# EAGLE design BlueBoltzESC (EAGLE 8.7.1)

## Sheet 1 of 6
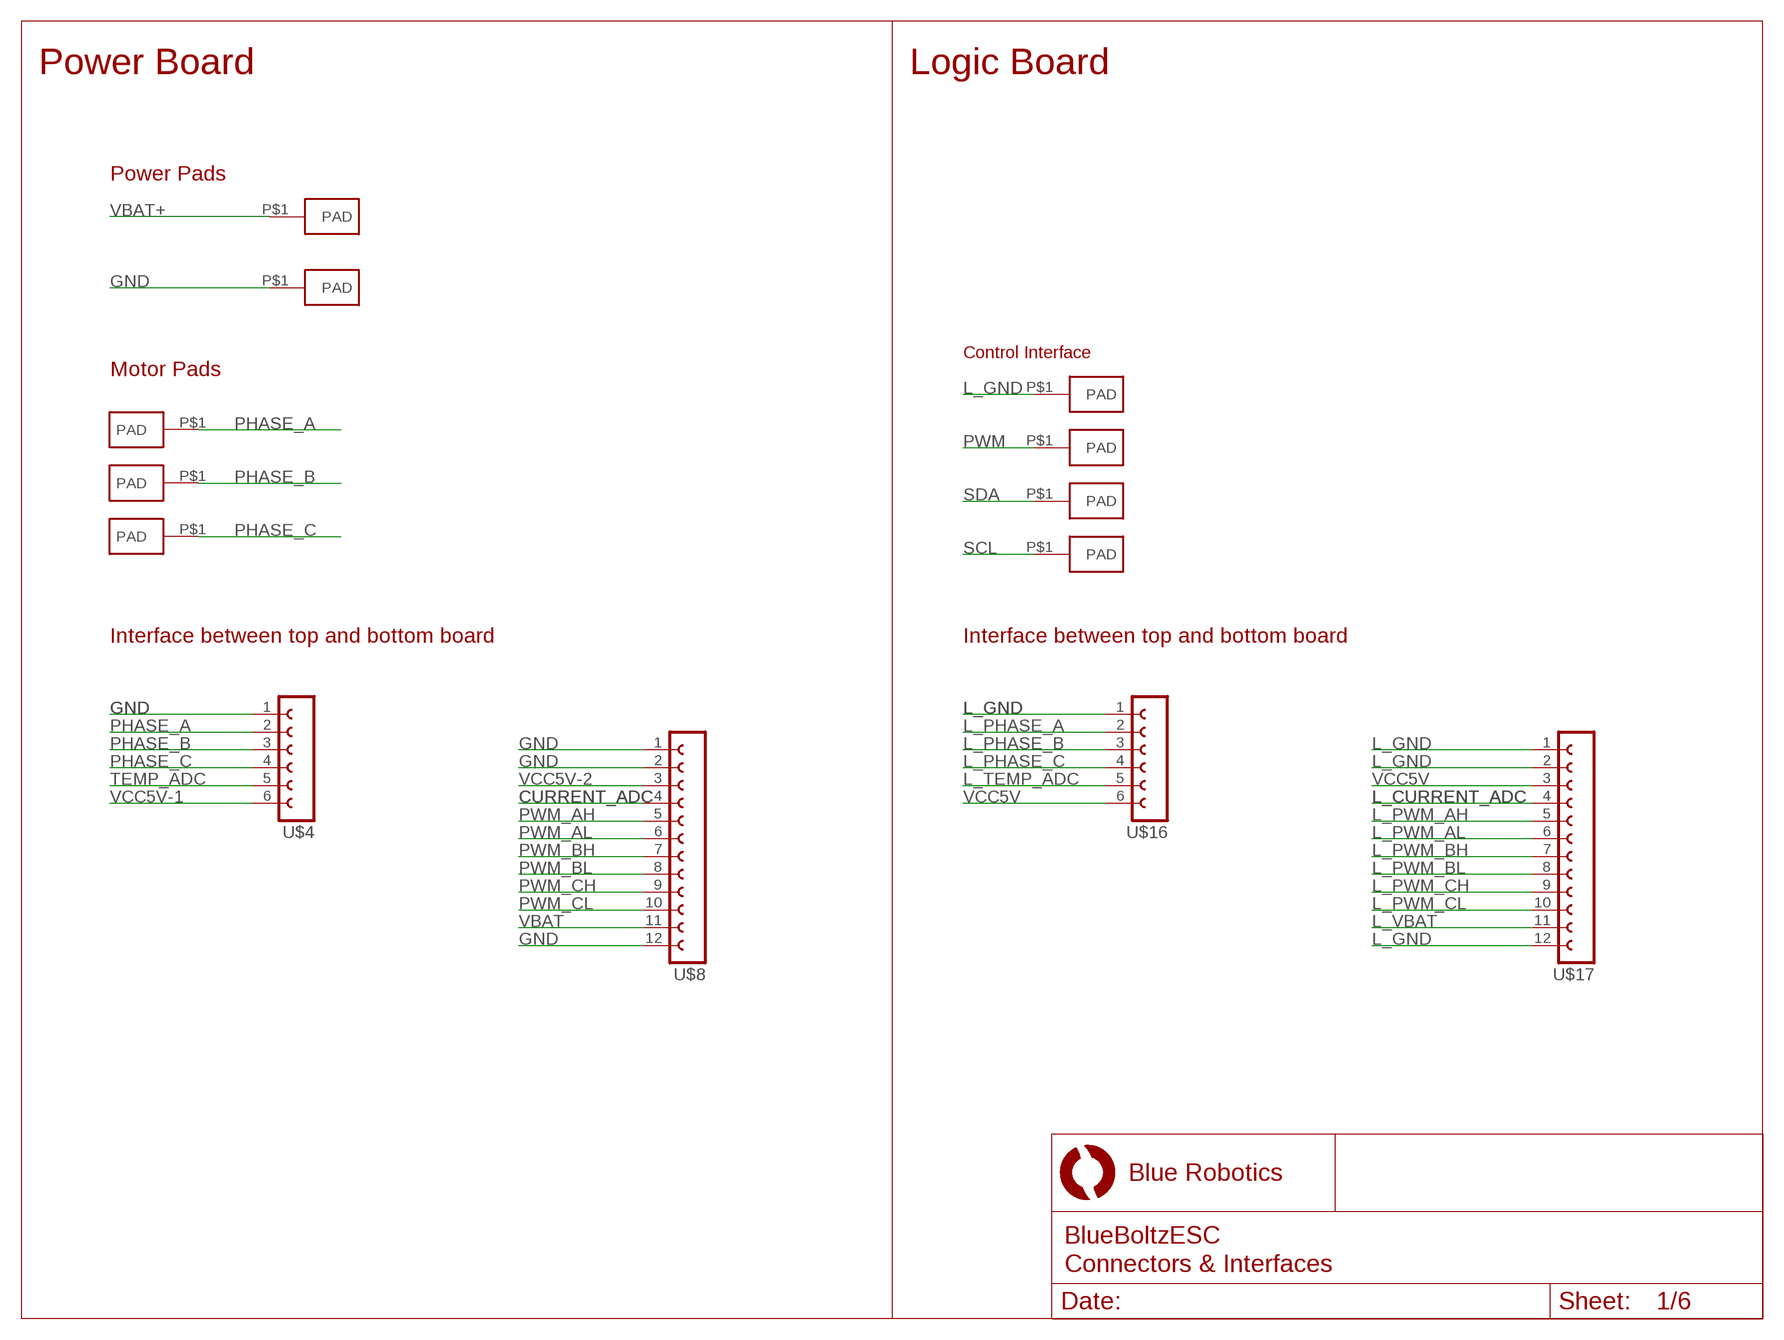
[diagram p0: schematic, sheet 1]

### Parts
U$1  PWR+  PADPTH-MED  [PAD-PTH-MED-1]
U$2  PWR-  PADPTH-MED  [PAD-PTH-MED-1]
U$4  FE06-1  [FE06]
U$5  A  PAD18AWG  [PAD-PTH-18AWG-1]
U$6  B  PAD18AWG  [PAD-PTH-18AWG-1]
U$7  C  PAD18AWG  [PAD-PTH-18AWG-1]
U$8  FE12-1  [FE12]
U$11  PAD1.5X3MM  [PAD-1.5X3MM]
U$12  PAD1.5X3MM  [PAD-1.5X3MM]
U$13  PAD1.5X3MM  [PAD-1.5X3MM]
U$14  PAD1.5X3MM  [PAD-1.5X3MM]
U$16  FE06-1  [FE06]
U$17  FE12-1  [FE12]

### Nets
CURRENT_ADC: U$8.4 ; also sheet 3
GND [PWR]: U$2.P$1(PAD) U$4.1 U$8.1 U$8.2 U$8.12 ; also sheet 2,3,4,6
L_CURRENT_ADC: U$17.4 ; also sheet 3
L_GND [SMD]: U$11.P$1(PAD) U$16.1 U$17.1 U$17.2 U$17.12 ; also sheet 2,3,4,5
L_PHASE_A: U$16.2 ; also sheet 5
L_PHASE_B: U$16.3 ; also sheet 5
L_PHASE_C: U$16.4 ; also sheet 5
L_PWM_AH [SMD]: U$17.5 ; also sheet 2
L_PWM_AL [SMD]: U$17.6 ; also sheet 2
L_PWM_BH [SMD]: U$17.7 ; also sheet 2
L_PWM_BL [SMD]: U$17.8 ; also sheet 2
L_PWM_CH [SMD]: U$17.9 ; also sheet 2
L_PWM_CL [SMD]: U$17.10 ; also sheet 2
L_TEMP_ADC [SMD]: U$16.5 ; also sheet 2
L_VBAT: U$17.11 ; also sheet 3,4
PHASE_A [PWR]: U$4.2 U$5.P$1(PAD) ; also sheet 6
PHASE_B [PWR]: U$4.3 U$6.P$1(PAD) ; also sheet 6
PHASE_C [PWR]: U$4.4 U$7.P$1(PAD) ; also sheet 6
PWM [SMD]: U$14.P$1(PAD) ; also sheet 2
PWM_AH: U$8.5 ; also sheet 6
PWM_AL: U$8.6 ; also sheet 6
PWM_BH: U$8.7 ; also sheet 6
PWM_BL: U$8.8 ; also sheet 6
PWM_CH: U$8.9 ; also sheet 6
PWM_CL: U$8.10 ; also sheet 6
SCL [SMD]: U$13.P$1(PAD) ; also sheet 2
SDA [SMD]: U$12.P$1(PAD) ; also sheet 2
TEMP_ADC: U$4.5 ; also sheet 3
VBAT [PWR]: U$8.11 ; also sheet 3,6
VBAT+ [PWR]: U$1.P$1(PAD) ; also sheet 2,3,4
VCC5V [SMD]: U$16.6 U$17.3 ; also sheet 2,4
VCC5V-1: U$4.6 ; also sheet 3
VCC5V-2: U$8.3 ; also sheet 3

### Notes on the sheet
- Power Board | Logic Board
- Power Pads
- Control Interface
- Motor Pads
- Interface between top and bottom board | Interface between top and bottom board

## Sheet 2 of 6
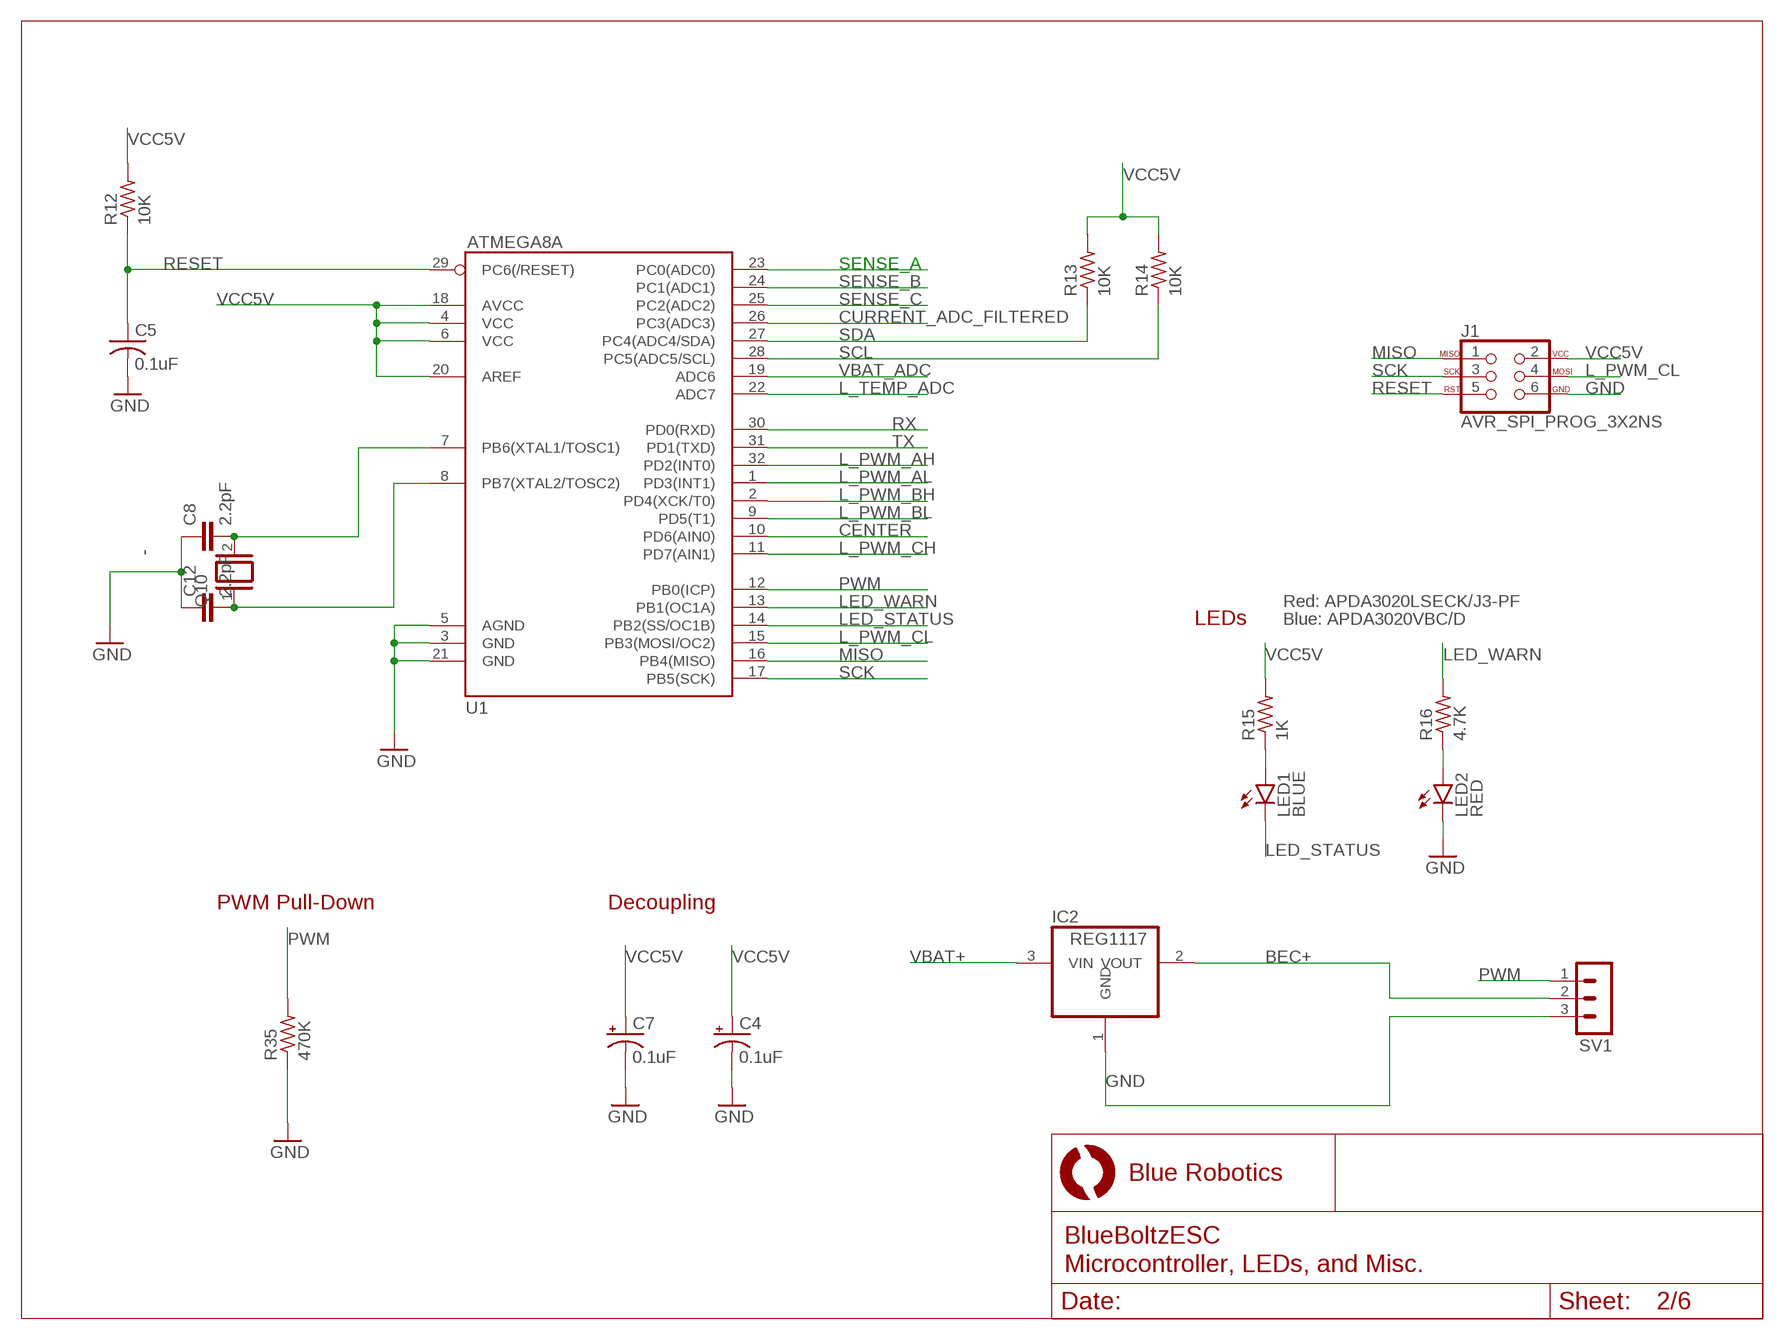
[diagram p1: schematic, sheet 2]

### Parts
C4  0.1uF  CPOL-USE2.5-6  [E2,5-6]
C5  0.1uF  C-US025-030X050  [C025-030X050]
C7  0.1uF  CPOL-USE2.5-6  [E2,5-6]
C8  2.2pF  C2.5/5  [C2.5-5]
C12  2.2pF  C2.5/5  [C2.5-5]
IC2  REG1117  [SOT223]
J1  AVR_SPI_PROG_3X2NS  [2X3-NS]
LED1  BLUE  LED3X2-RA  [SMT-LED-3X2-RA]
LED2  RED  LED3X2-RA  [SMT-LED-3X2-RA]
Q10  XTAL/S  [QS]
R12  10K  R-US_M3216  [M3216]
R13  10K  R-US_M3216  [M3216]
R14  10K  R-US_M3216  [M3216]
R15  1K  R-US_M3216  [M3216]
R16  4.7K  R-US_0207/10  [0207/10]
R35  470K  R-US_0207/10  [0207/10]
SV1  MA03-1  [MA03-1]
U1  ATMEGA168  [TQFP32-08]

### Nets
BEC+: IC2.2(VOUT) SV1.2
CENTER [SMD]: U1.10(PD6(AIN0)) ; also sheet 5
CURRENT_ADC_FILTERED [SMD]: U1.26(PC3(ADC3)) ; also sheet 3
GND [PWR]: IC2.1(GND) J1.6 SV1.3 ; also sheet 1,3,4,6
L_GND [SMD]: C4.- C5.2 C7.- C8.1 C12.1 LED2.2(C) R35.1 U1.3(GND) U1.5(AGND) U1.21(GND) ; supply symbol labelled GND ; also sheet 1,3,4,5
L_PWM_AH [SMD]: U1.32(PD2(INT0)) ; also sheet 1
L_PWM_AL [SMD]: U1.1(PD3(INT1)) ; also sheet 1
L_PWM_BH [SMD]: U1.2(PD4(XCK/T0)) ; also sheet 1
L_PWM_BL [SMD]: U1.9(PD5(T1)) ; also sheet 1
L_PWM_CH [SMD]: U1.11(PD7(AIN1)) ; also sheet 1
L_PWM_CL [SMD]: J1.4 U1.15(PB3(MOSI/OC2)) ; also sheet 1
L_TEMP_ADC [SMD]: U1.22(ADC7) ; also sheet 1
LED_STATUS [SMD]: LED1.2(C) U1.14(PB2(SS/OC1B))
LED_WARN [SMD]: R16.2 U1.13(PB1(OC1A))
MISO [SMD]: J1.1 U1.16(PB4(MISO))
N$3: LED2.1(A) R16.1
N$10 [SMD]: C8.2 Q10.2 U1.7(PB6(XTAL1/TOSC1))
N$11 [SMD]: C12.2 Q10.1 U1.8(PB7(XTAL2/TOSC2))
N$16: LED1.1(A) R15.1
PWM [SMD]: R35.2 SV1.1 U1.12(PB0(ICP)) ; also sheet 1
RESET [SMD]: C5.1 J1.5 R12.1 U1.29(PC6(/RESET))
RX [SMD]: U1.30(PD0(RXD))
SCK [SMD]: J1.3 U1.17(PB5(SCK))
SCL [SMD]: R14.1 U1.28(PC5(ADC5/SCL)) ; also sheet 1
SDA [SMD]: R13.1 U1.27(PC4(ADC4/SDA)) ; also sheet 1
SENSE_A [SMD]: U1.23(PC0(ADC0)) ; also sheet 5
SENSE_B [SMD]: U1.24(PC1(ADC1)) ; also sheet 5
SENSE_C [SMD]: U1.25(PC2(ADC2)) ; also sheet 5
TX [SMD]: U1.31(PD1(TXD))
VBAT+ [PWR]: IC2.3(VIN) ; also sheet 1,3,4
VBAT_ADC [SMD]: U1.19(ADC6) ; also sheet 3
VCC5V [SMD]: C4.+ C7.+ J1.2 R12.2 R13.2 R14.2 R15.2 U1.4(VCC) U1.6(VCC) U1.18(AVCC) U1.20(AREF) ; also sheet 1,4

### Notes on the sheet
- ATMEGA8A
- Red: APDA3020LSECK/J3-PF
- LEDs | Blue: APDA3020VBC/D
- PWM Pull-Down | Decoupling

## Sheet 3 of 6
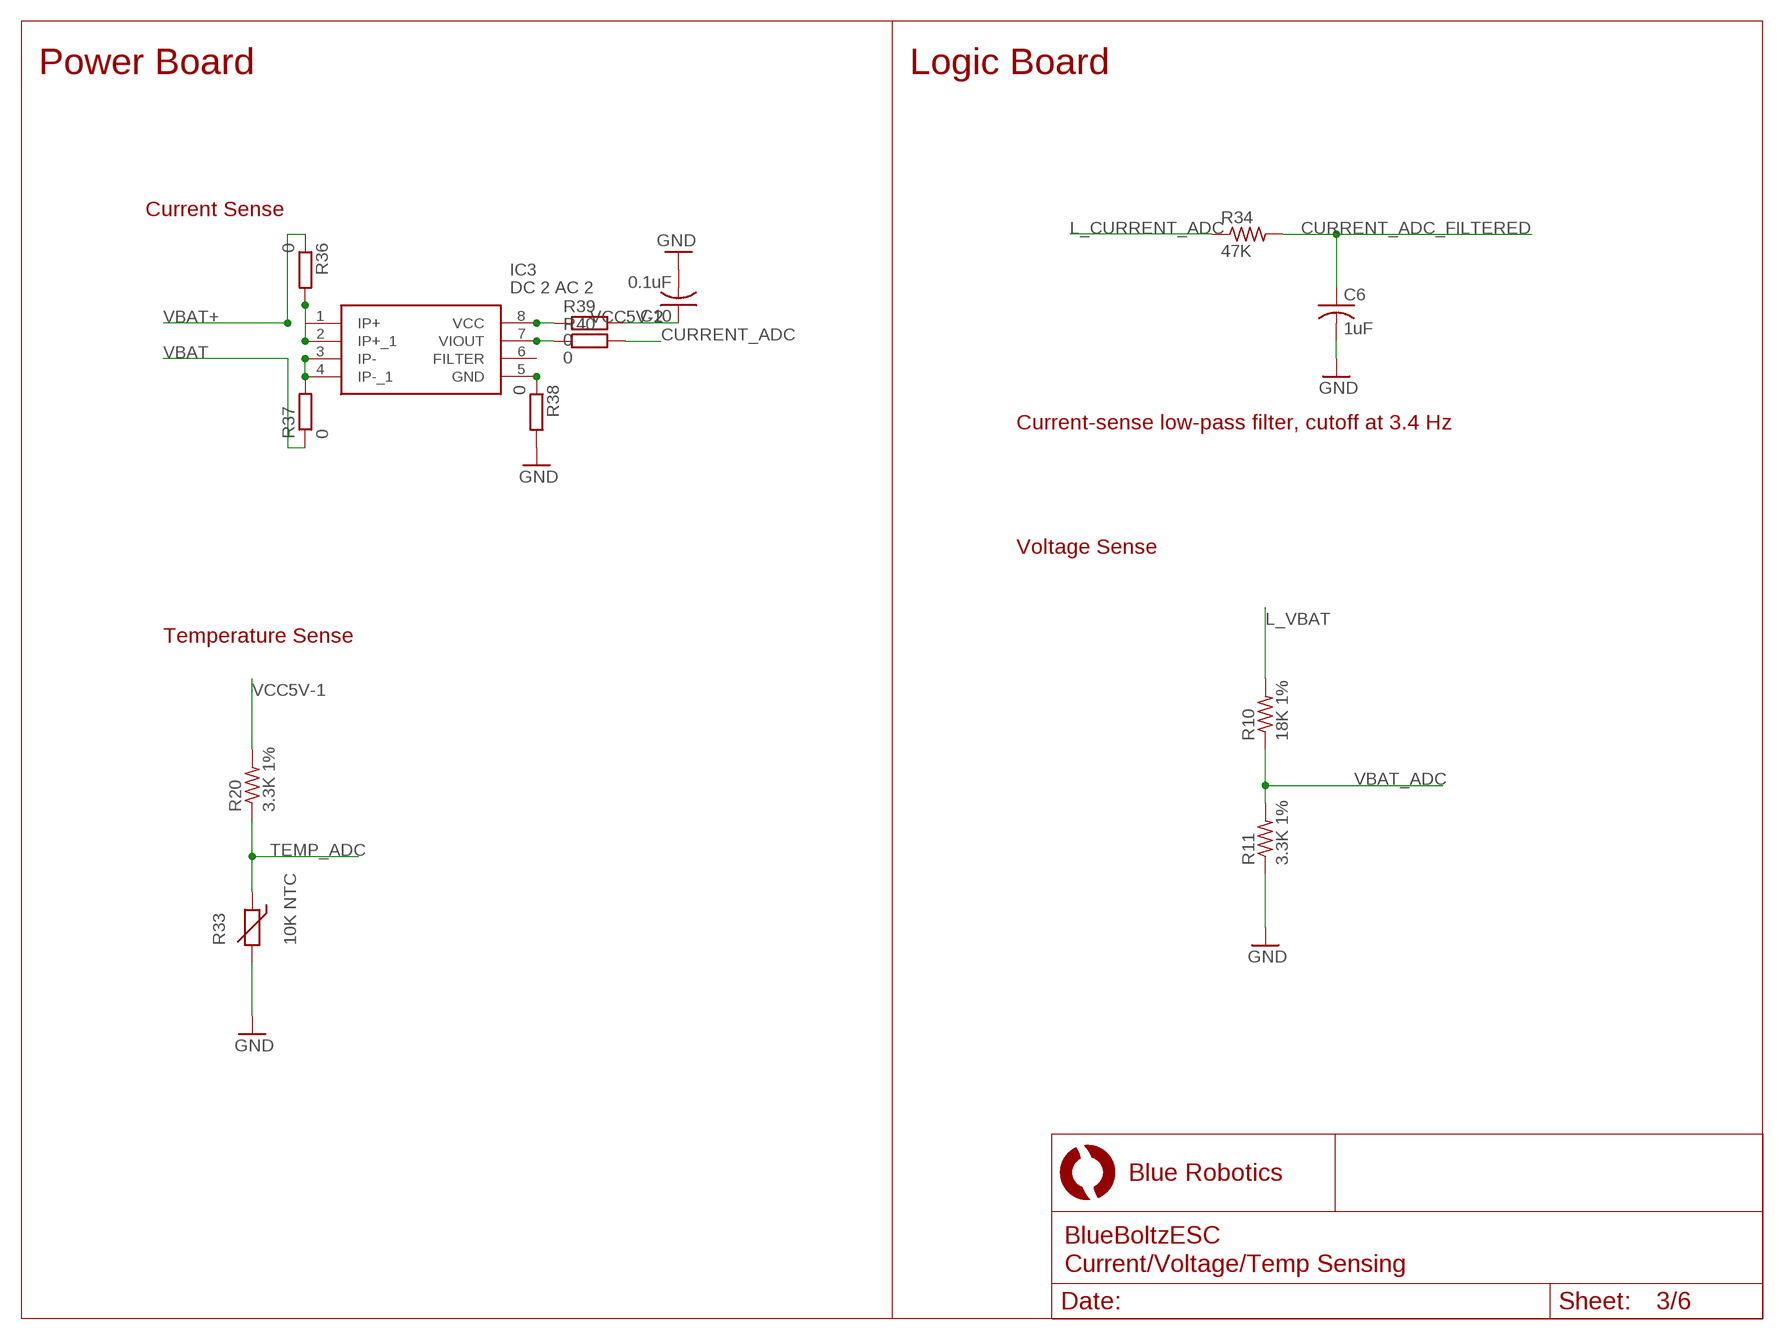
[diagram p2: schematic, sheet 3]

### Parts
C6  1uF  C-US025-030X050  [C025-030X050]
C10  0.1uF  C-US025-030X050  [C025-030X050]
IC3  DC 2 AC 2  ACS712ELCTR-20A-T  [SOIC127P600X175-8N]
R10  18K 1%  R-US_0207/10  [0207/10]
R11  3.3K 1%  R-US_0207/10  [0207/10]
R20  3.3K 1%  R-US_0207/10  [0207/10]
R33  10K NTC  THERMISTOR-5  [R-5]
R34  47K  R-US_0207/10  [0207/10]
R36  0  R-EU_MELF0102R  [MINI_MELF-0102R]
R37  0  R-EU_MELF0102R  [MINI_MELF-0102R]
R38  0  R-EU_MELF0102R  [MINI_MELF-0102R]
R39  0  R-EU_MELF0102R  [MINI_MELF-0102R]
R40  0  R-EU_MELF0102R  [MINI_MELF-0102R]

### Nets
CURRENT_ADC: R40.2 ; also sheet 1
CURRENT_ADC_FILTERED [SMD]: C6.1 R34.2 ; also sheet 2
GND [PWR]: C10.2 R33.2 R38.2 ; also sheet 1,2,4,6
L_CURRENT_ADC: R34.1 ; also sheet 1
L_GND [SMD]: C6.2 R11.1 ; supply symbol labelled GND ; also sheet 1,2,4,5
L_VBAT: R10.2 ; also sheet 1,4
N$1 [SMD]: IC3.1(IP+) IC3.2(IP+_1) R36.2
N$8 [SMD]: IC3.3(IP-) IC3.4(IP-_1) R37.2
N$13: IC3.5(GND) R38.1
N$14 [SMD]: IC3.8(VCC) R39.1
N$17 [SMD]: IC3.7(VIOUT) R40.1
TEMP_ADC: R20.1 R33.1 ; also sheet 1
VBAT [PWR]: R37.1 ; also sheet 1,6
VBAT+ [PWR]: R36.1 ; also sheet 1,2,4
VBAT_ADC [SMD]: R10.1 R11.2 ; also sheet 2
VCC5V-1: R20.2 ; also sheet 1
VCC5V-2: C10.1 R39.2 ; also sheet 1
Unconnected: IC3.6(FILTER)

### Notes on the sheet
- Power Board | Logic Board
- Current Sense
- Current-sense low-pass filter, cutoff at 3.4 Hz
- Voltage Sense
- Temperature Sense

## Sheet 4 of 6
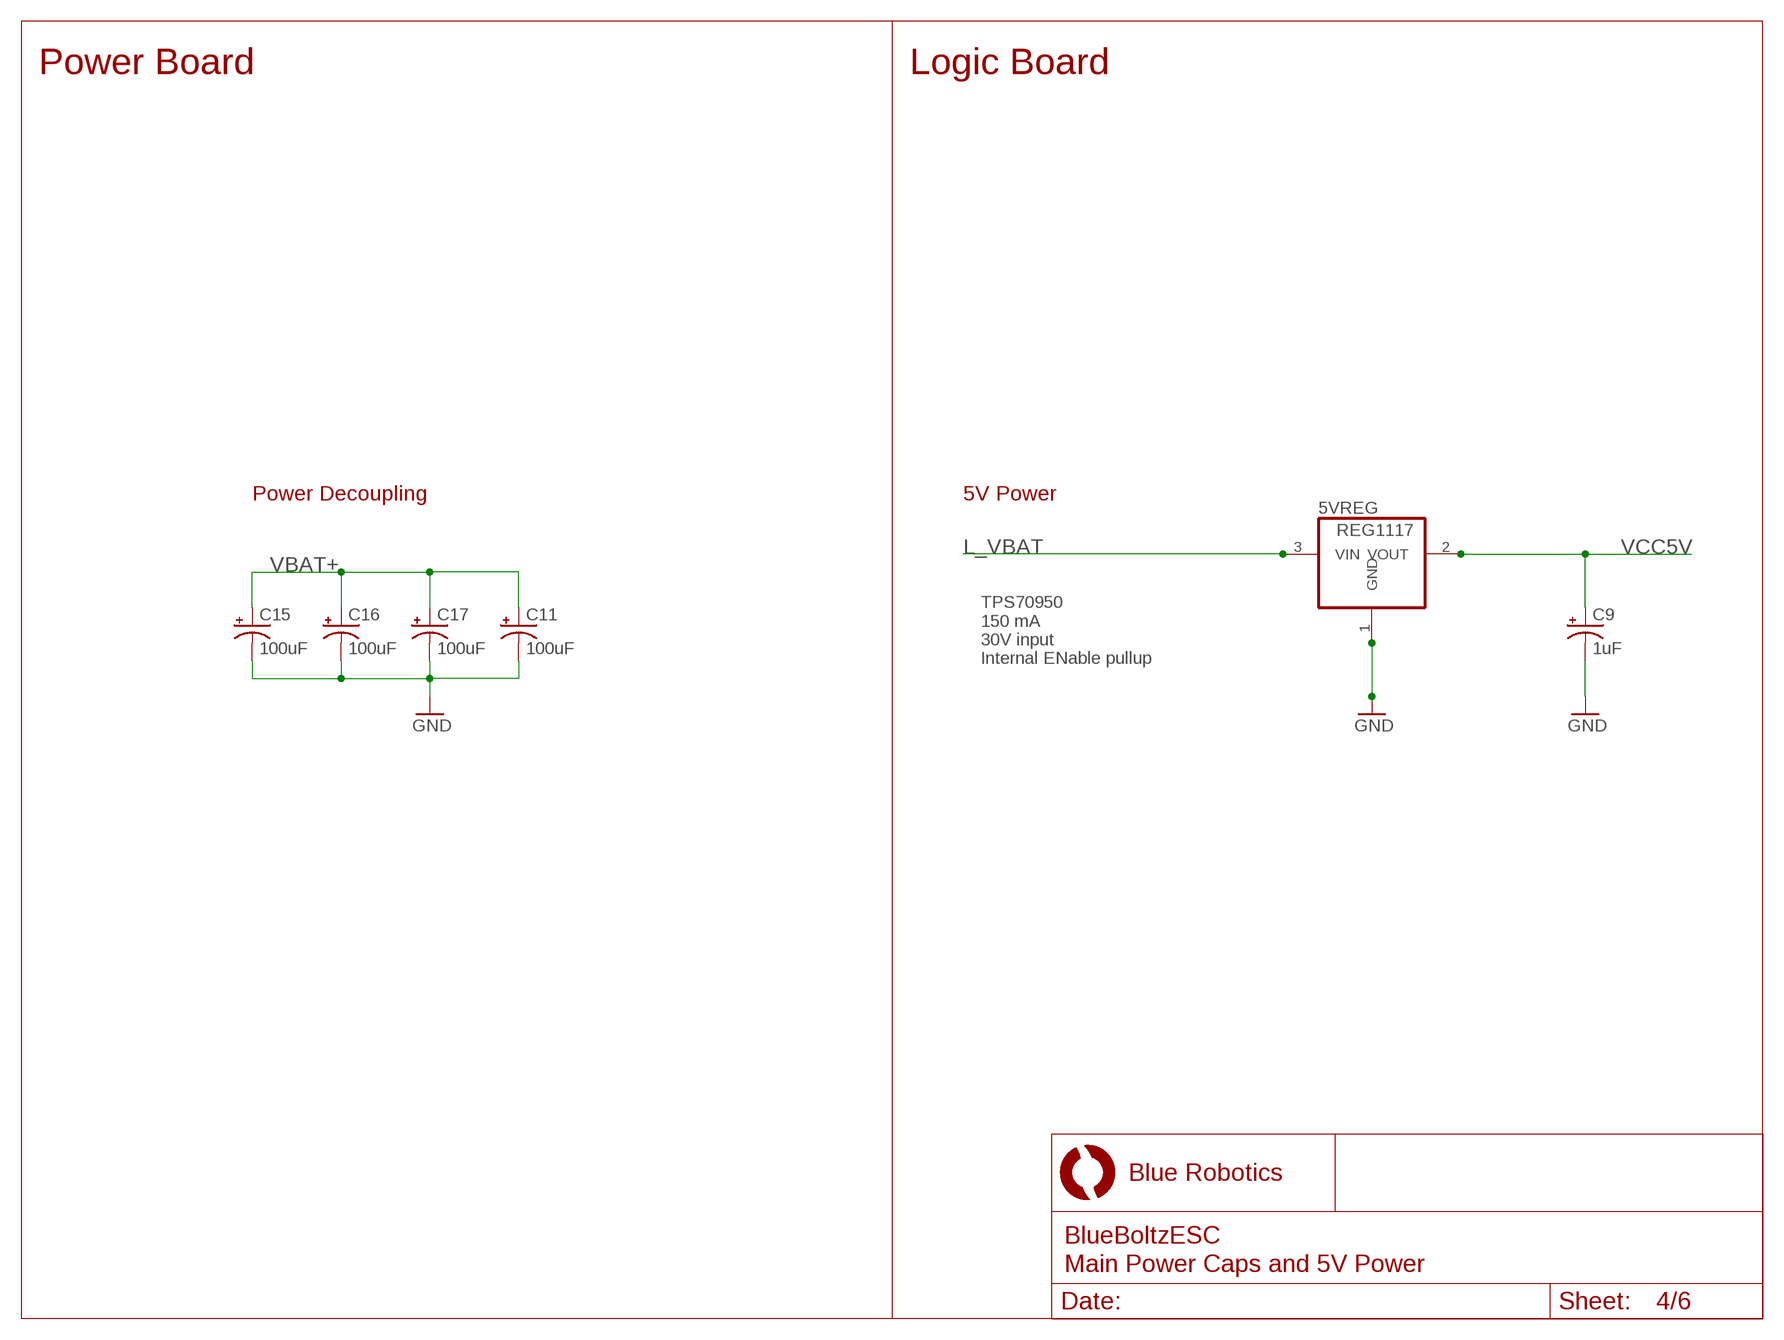
[diagram p3: schematic, sheet 4]

### Parts
5VREG  REG1117  [SOT223]
C9  1uF  CPOL-USE2.5-7  [E2,5-7]
C11  100uF  CPOL-USE3.5-8  [E3,5-8]
C15  100uF  CPOL-USE3.5-8  [E3,5-8]
C16  100uF  CPOL-USE3.5-8  [E3,5-8]
C17  100uF  CPOL-USE3.5-8  [E3,5-8]

### Nets
GND [PWR]: C11.- C15.- C16.- C17.- ; also sheet 1,2,3,6
L_GND [SMD]: 5VREG.1(GND) C9.- ; supply symbol labelled GND ; also sheet 1,2,3,5
L_VBAT: 5VREG.3(VIN) ; also sheet 1,3
VBAT+ [PWR]: C11.+ C15.+ C16.+ C17.+ ; also sheet 1,2,3
VCC5V [SMD]: 5VREG.2(VOUT) C9.+ ; also sheet 1,2

### Notes on the sheet
- Power Board | Logic Board
- Power Decoupling | 5V Power
- TPS70950
  150 mA
  30V input
  Internal ENable pullup

## Sheet 5 of 6
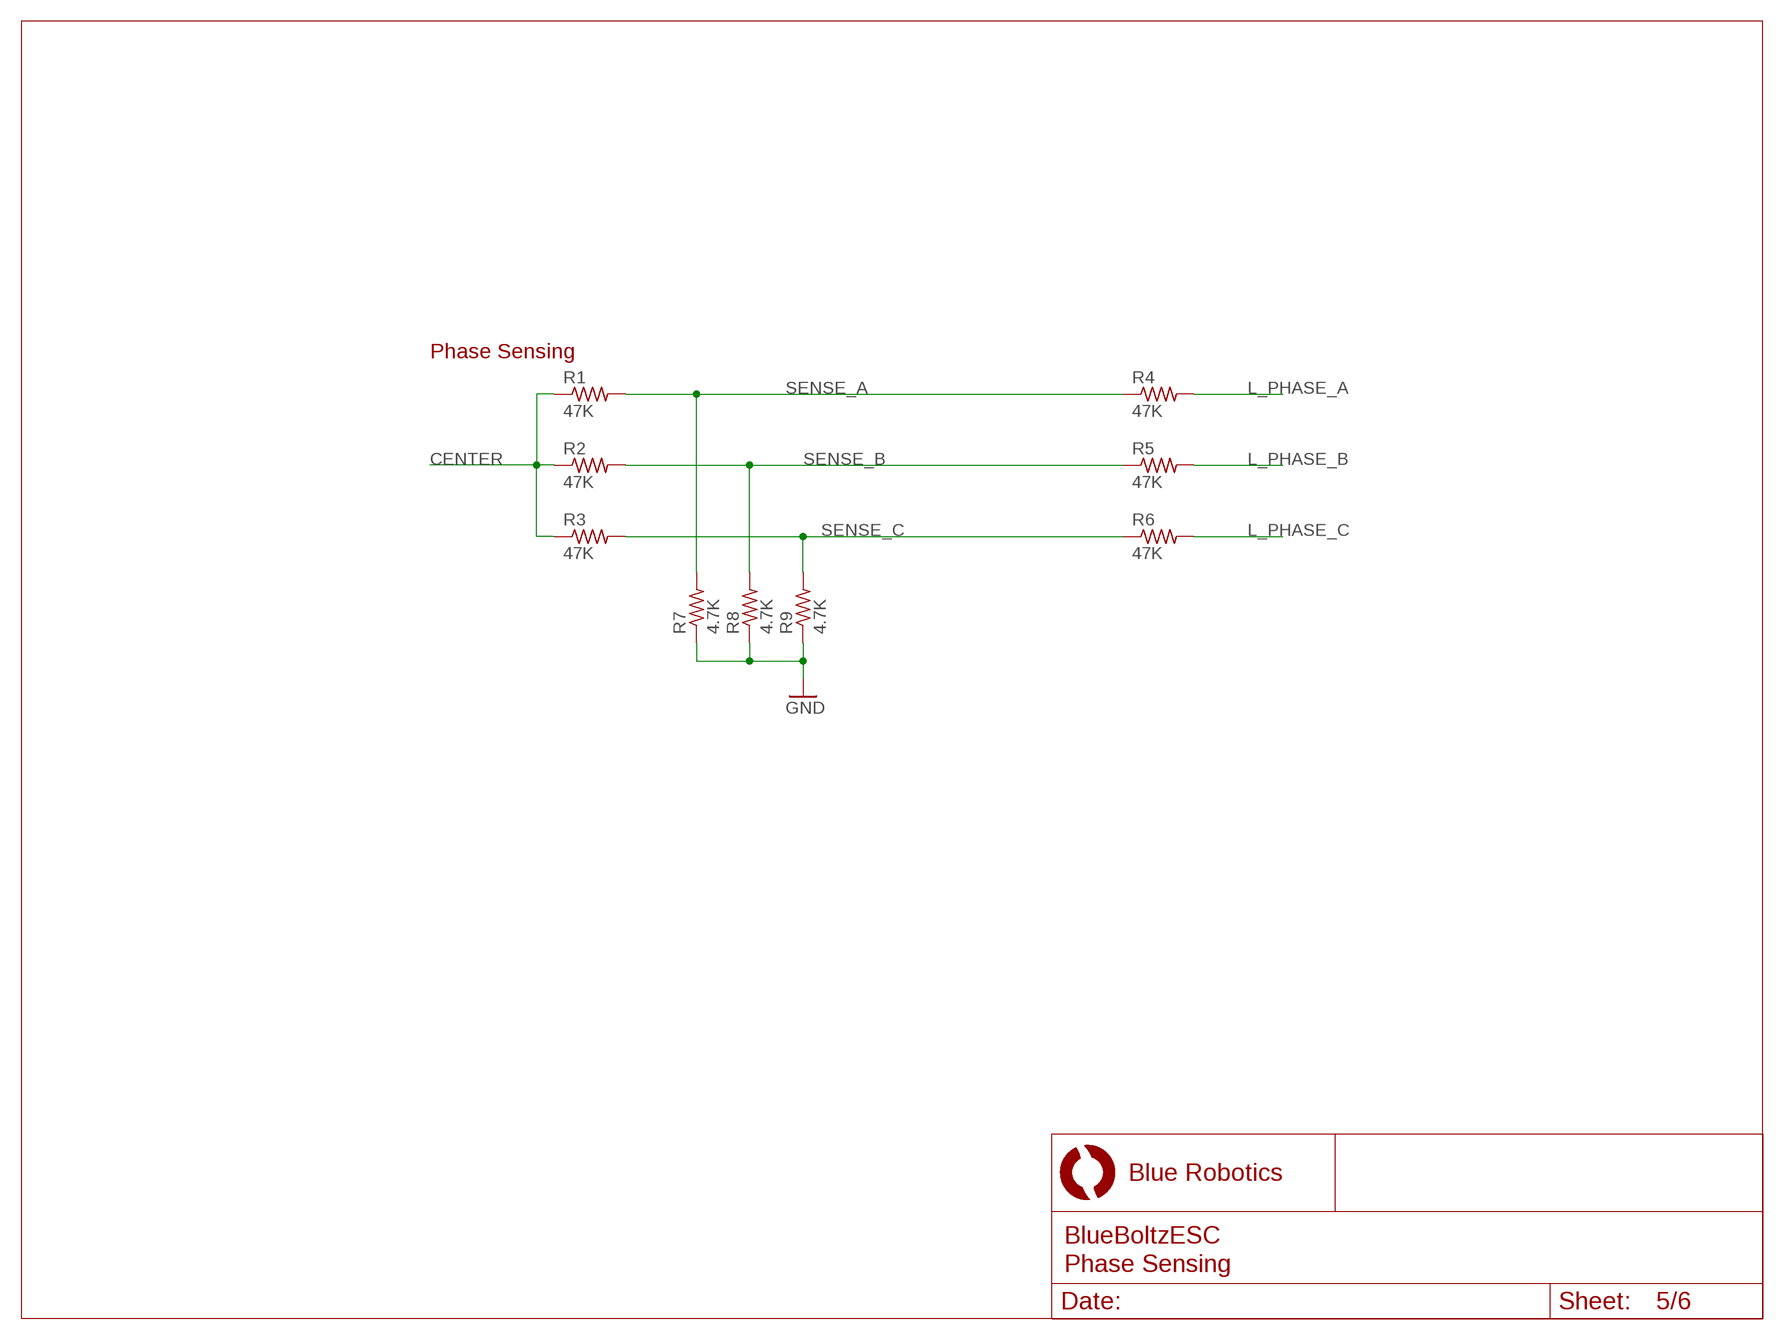
[diagram p4: schematic, sheet 5]

### Parts
R1  47K  R-US_0207/10  [0207/10]
R2  47K  R-US_0207/10  [0207/10]
R3  47K  R-US_0207/10  [0207/10]
R4  47K  R-US_0207/10  [0207/10]
R5  47K  R-US_0207/10  [0207/10]
R6  47K  R-US_0207/10  [0207/10]
R7  4.7K  R-US_0207/10  [0207/10]
R8  4.7K  R-US_0207/10  [0207/10]
R9  4.7K  R-US_0207/10  [0207/10]

### Nets
CENTER [SMD]: R1.1 R2.1 R3.1 ; also sheet 2
L_GND [SMD]: R7.1 R8.1 R9.1 ; supply symbol labelled GND ; also sheet 1,2,3,4
L_PHASE_A: R4.2 ; also sheet 1
L_PHASE_B: R5.2 ; also sheet 1
L_PHASE_C: R6.2 ; also sheet 1
SENSE_A [SMD]: R1.2 R4.1 R7.2 ; also sheet 2
SENSE_B [SMD]: R2.2 R5.1 R8.2 ; also sheet 2
SENSE_C [SMD]: R3.2 R6.1 R9.2 ; also sheet 2

### Notes on the sheet
- Phase Sensing

## Sheet 6 of 6
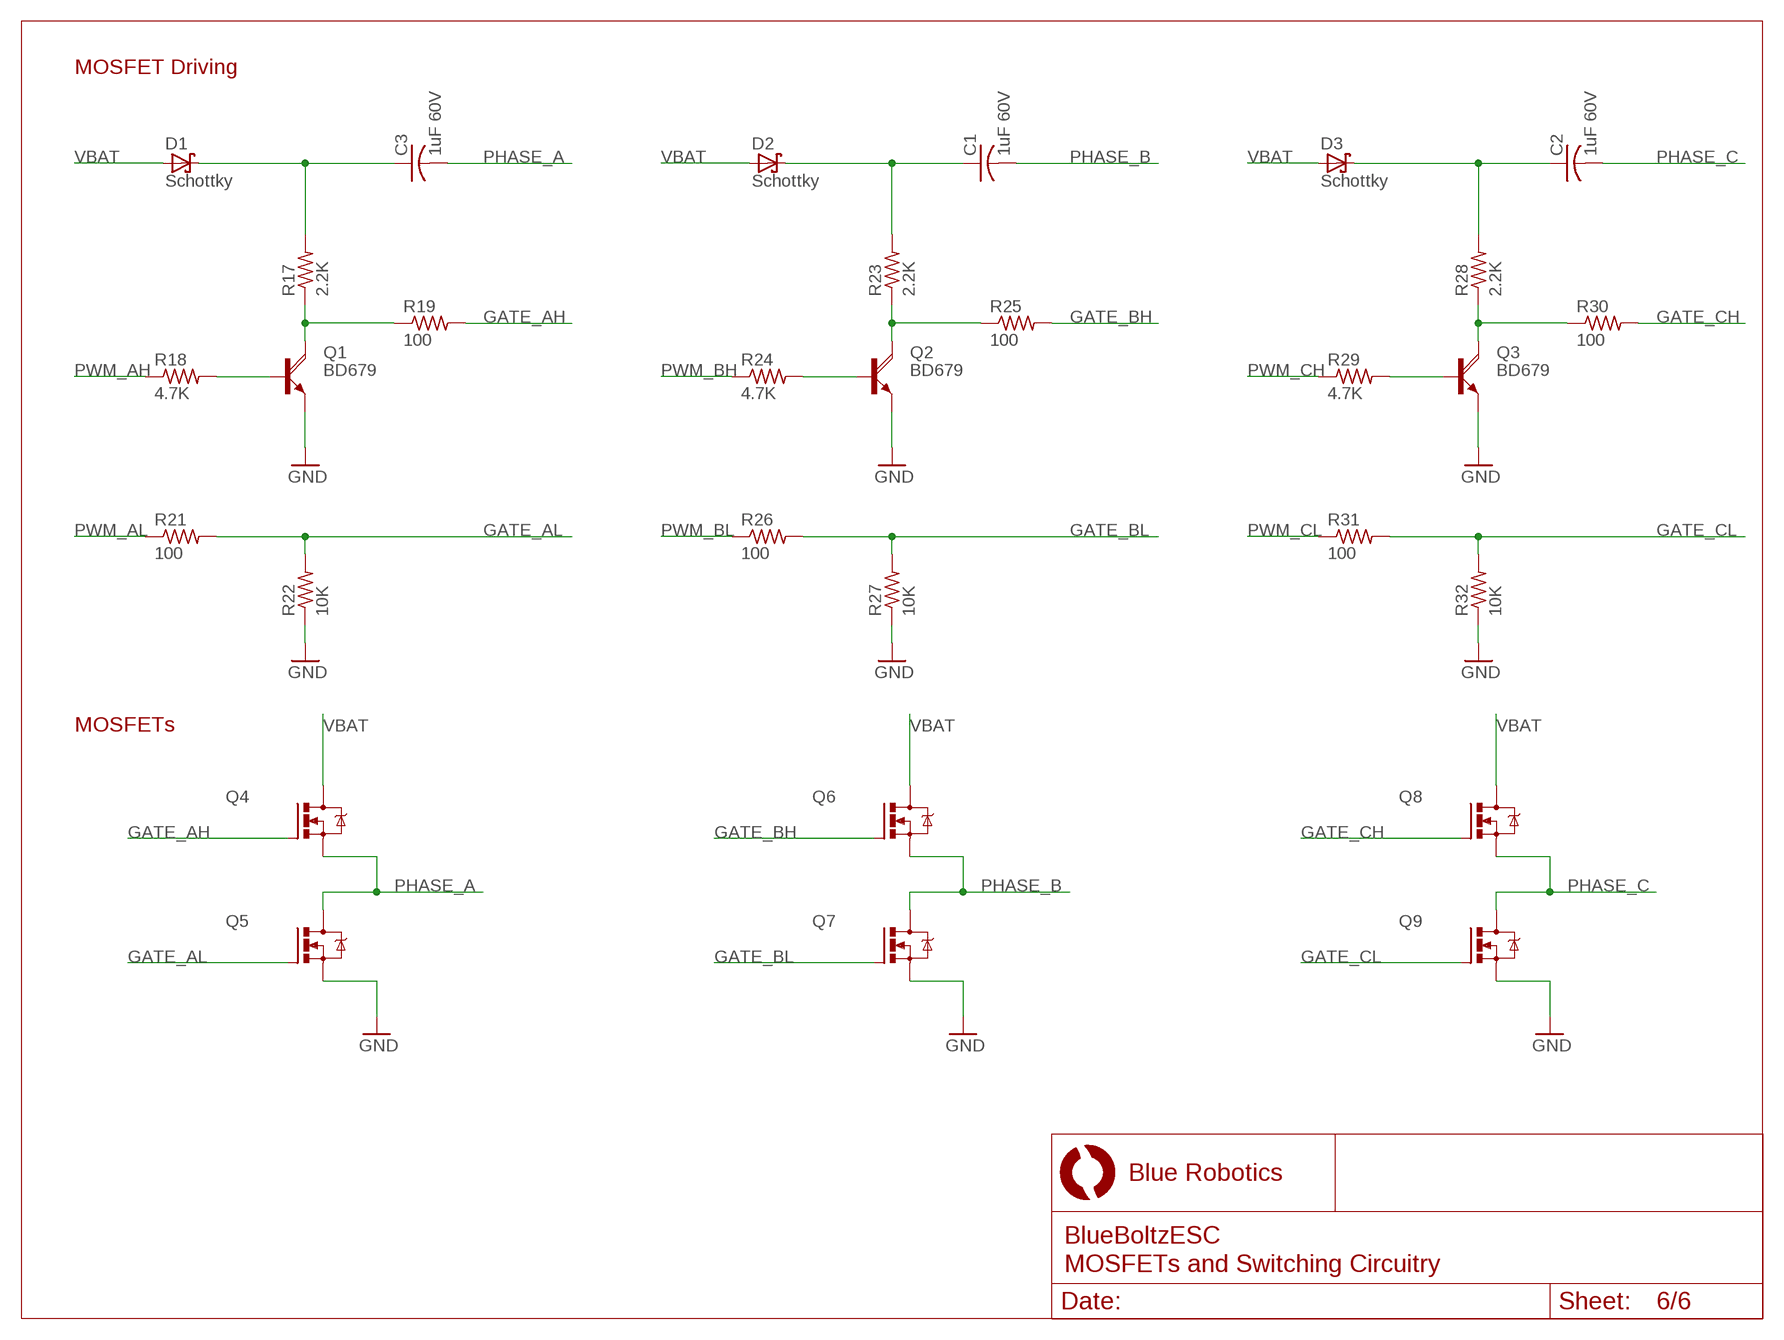
[diagram p5: schematic, sheet 6]

### Parts
C1  1uF 60V  C-US025-040X050  [C025-040X050]
C2  1uF 60V  C-US025-040X050  [C025-040X050]
C3  1uF 60V  C-US025-040X050  [C025-040X050]
D1  Schottky  SCHOTTKY-DIODEDO35-7  [DO35-7]
D2  Schottky  SCHOTTKY-DIODEDO35-7  [DO35-7]
D3  Schottky  SCHOTTKY-DIODEDO35-7  [DO35-7]
Q1  BD679  [TO126AV]
Q2  BD679  [TO126AV]
Q3  BD679  [TO126AV]
Q4  IRLZ44Z  [TO220BH]
Q5  IRLZ44Z  [TO220BH]
Q6  IRLZ44Z  [TO220BH]
Q7  IRLZ44Z  [TO220BH]
Q8  IRLZ44Z  [TO220BH]
Q9  IRLZ44Z  [TO220BH]
R17  2.2K  R-US_0207/10  [0207/10]
R18  4.7K  R-US_0207/10  [0207/10]
R19  100  R-US_M3216  [M3216]
R21  100  R-US_M3216  [M3216]
R22  10K  R-US_M3216  [M3216]
R23  2.2K  R-US_0207/10  [0207/10]
R24  4.7K  R-US_0207/10  [0207/10]
R25  100  R-US_M3216  [M3216]
R26  100  R-US_M3216  [M3216]
R27  10K  R-US_M3216  [M3216]
R28  2.2K  R-US_0207/10  [0207/10]
R29  4.7K  R-US_0207/10  [0207/10]
R30  100  R-US_M3216  [M3216]
R31  100  R-US_M3216  [M3216]
R32  10K  R-US_M3216  [M3216]

### Nets
GATE_AH: Q4.G R19.2
GATE_AL: Q5.G R21.2 R22.2
GATE_BH: Q6.G R25.2
GATE_BL: Q7.G R26.2 R27.2
GATE_CH: Q8.G R30.2
GATE_CL: Q9.G R31.2 R32.2
GND [PWR]: Q1.E Q2.E Q3.E Q5.S Q7.S Q9.S R22.1 R27.1 R32.1 ; also sheet 1,2,3,4
N$2: Q1.B R18.2
N$4: Q1.C R17.1 R19.1
N$5: Q2.B R24.2
N$6: Q2.C R23.1 R25.1
N$7: Q3.B R29.2
N$9: Q3.C R28.1 R30.1
N$12: C3.1 D1.C R17.2
N$15: C1.1 D2.C R23.2
N$19: C2.1 D3.C R28.2
PHASE_A [PWR]: C3.2 Q4.S Q5.D ; also sheet 1
PHASE_B [PWR]: C1.2 Q6.S Q7.D ; also sheet 1
PHASE_C [PWR]: C2.2 Q8.S Q9.D ; also sheet 1
PWM_AH: R18.1 ; also sheet 1
PWM_AL: R21.1 ; also sheet 1
PWM_BH: R24.1 ; also sheet 1
PWM_BL: R26.1 ; also sheet 1
PWM_CH: R29.1 ; also sheet 1
PWM_CL: R31.1 ; also sheet 1
VBAT [PWR]: D1.A D2.A D3.A Q4.D Q6.D Q8.D ; also sheet 1,3

### Notes on the sheet
- MOSFET Driving
- MOSFETs

## Library data of the parts
5VREG IC2 = burr-brown:REG1117: 800mA and 1A Low Dropout (LDO) Positive Regulator 1.8V, 2.5V, 2.85V, 3.3V, 5V, and Adj; MPN: REG1117; OC_FARNELL: 1097566; OC_NEWARK: 14P6981
C1-C3 = resistor:C-US: CAPACITOR, American symbol
C4 C7 C9 C11 C15-C17 = rcl:CPOL-US: POLARIZED CAPACITOR, American symbol
C5 C6 C10 = rcl:C-US: CAPACITOR, American symbol
C8 C12 = capacitor-wima:C: CAPACITOR naming: grid - package width
D1-D3 = diode:SCHOTTKY-DIODE: Schottky Diode
IC3 = SamacSys_Parts:ACS712ELCTR-20A-T: ACS712ELCTR-20A-T, Hall Effect Sensor 5V 8-Pin SOIC, SOIC N Source: Datasheet <http://docs-europe.electrocomponents.com/webdocs/0d88/0900766b80d885f5.pdf>; ALLIED_NUMBER: R1076682; ALLIED_PRICE/STOCK: http://www.alliedelec.com/allegro-microsystems-acs712elctr-20a-t/R1076682/; DESCRIPTION: ACS712ELCTR-20A-T, Hall Effect Sensor 5V 8-Pin SOIC, SOIC N; HEIGHT: 1.75mm; MANUFACTURER_NAME: Allegro Microsystems; MANUFACTURER_PART_NUMBER: ACS712ELCTR-20A-T; RS_PART_NUMBER: 6807135P; RS_PRICE/STOCK: http://uk.rs-online.com/web/p/products/6807135P; SPICEPREFIX: I
J1 = SparkFun-Connectors:AVR_SPI_PROG_3X2: AVR ISP 6 Pin This is the reduced ISP connector for AVR programming. Common on Arduino. This footprint will take up less PCB space and can be used with a 10-pin to 6-pin adapter such as SKU: BOB-08508 **Special note about "TEST_POINT" package. The stop mask is on the top side, so if you want your programming test points to be on the bottom of your board, make sure to place this package on the bottom side of the board. This also ensure that the orientation to program from the bottom side will be correct. SparkFun Products: SparkFun ISP Pogo Adapter <https://www.sparkfun.com/products/11591> - NS Tiny AVR Programmer <https://www.sparkfun.com/products/11801> -PTH
LED1 LED2 = BR-Eagle-Library:LED: LEDs Standard schematic elements and footprints for 5mm, 3mm, 1206, and 0603 sized LEDs. 5mm - Spark Fun Electronics SKU : COM-00529 (and others)
Q1-Q3 = transistor-power:BD679: NPN DARLINGTON TRANSISTOR
Q4-Q9 = transistor-power:IRLZ44Z: N-Channel HEXFET® Power MOSFET Logic Level AUTOMOTIVE MOSFET Source: http://www.irf.com/product-info/datasheets/data/irlz44zpbf.pdf
Q10 = special:XTAL/S: CRYSTAL
R1-R32 R34 R35 = resistor:R-US_: RESISTOR, American symbol
R33 = varistor:THERMISTOR: THERMISTOR
R36-R40 = rcl:R-EU_: RESISTOR, European symbol
SV1 = con-lstb:MA03-1: PIN HEADER; OC_FARNELL: unknown; OC_NEWARK: unknown
U1 = SparkFun-DigitalIC:ATMEGA168: Atmel 32-pin 8-bit micro, 16k flash.; SPICEPREFIX: X
U$1 U$2 U$5-U$7 U$11-U$14 = BR-Eagle-Library:PAD
U$4 U$16 = con-lsta:FE06-1: FEMALE HEADER; OC_FARNELL: unknown; OC_NEWARK: unknown
U$8 U$17 = con-lsta:FE12-1: FEMALE HEADER; OC_FARNELL: unknown; OC_NEWARK: unknown

## Net classes
0 default: width 0.381 mm, drill 0.8 mm, clearance 0.203 mm
1 PWR: width 1.524 mm, drill 0.8 mm, clearance 0.457 mm
2 SMD: width 0.33 mm, drill 0.5 mm, clearance 0.1 mm

## Board
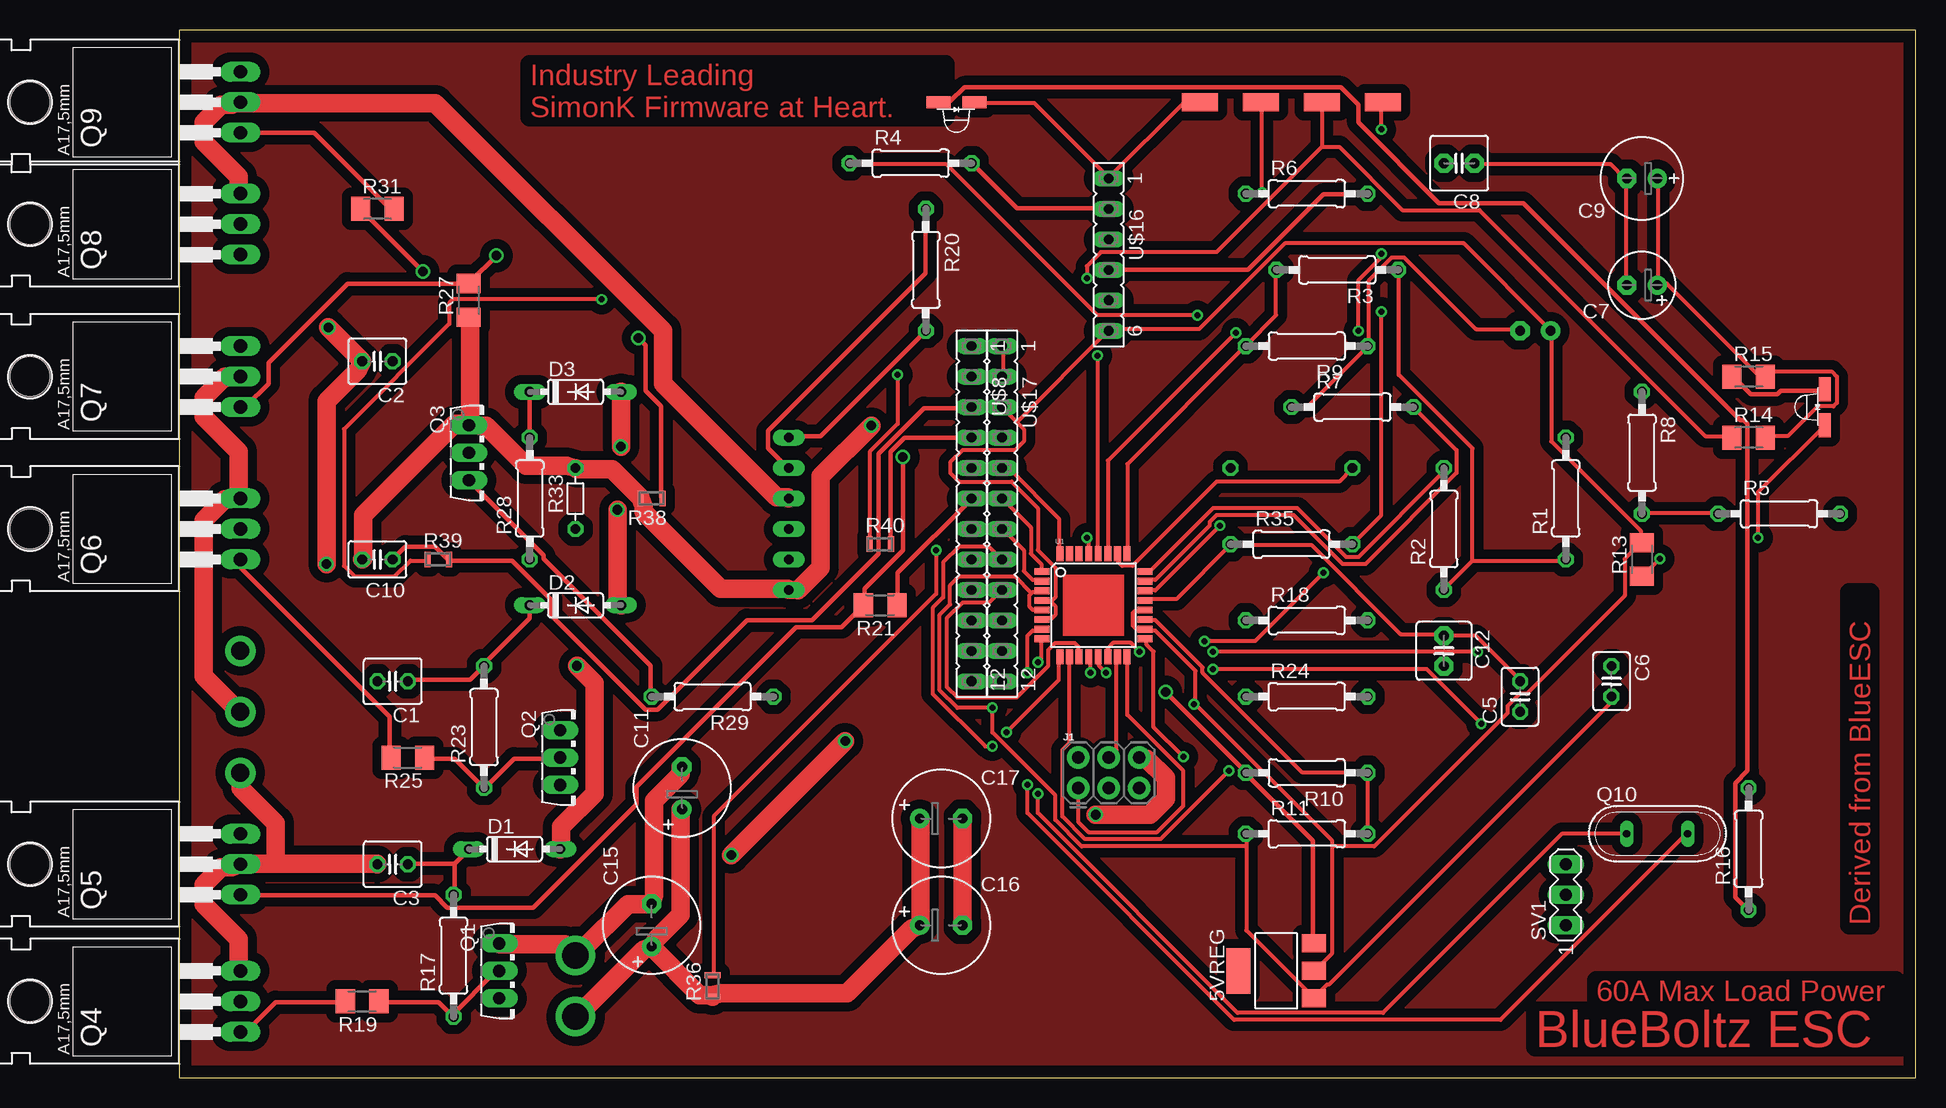
[diagram p6: board, top side]
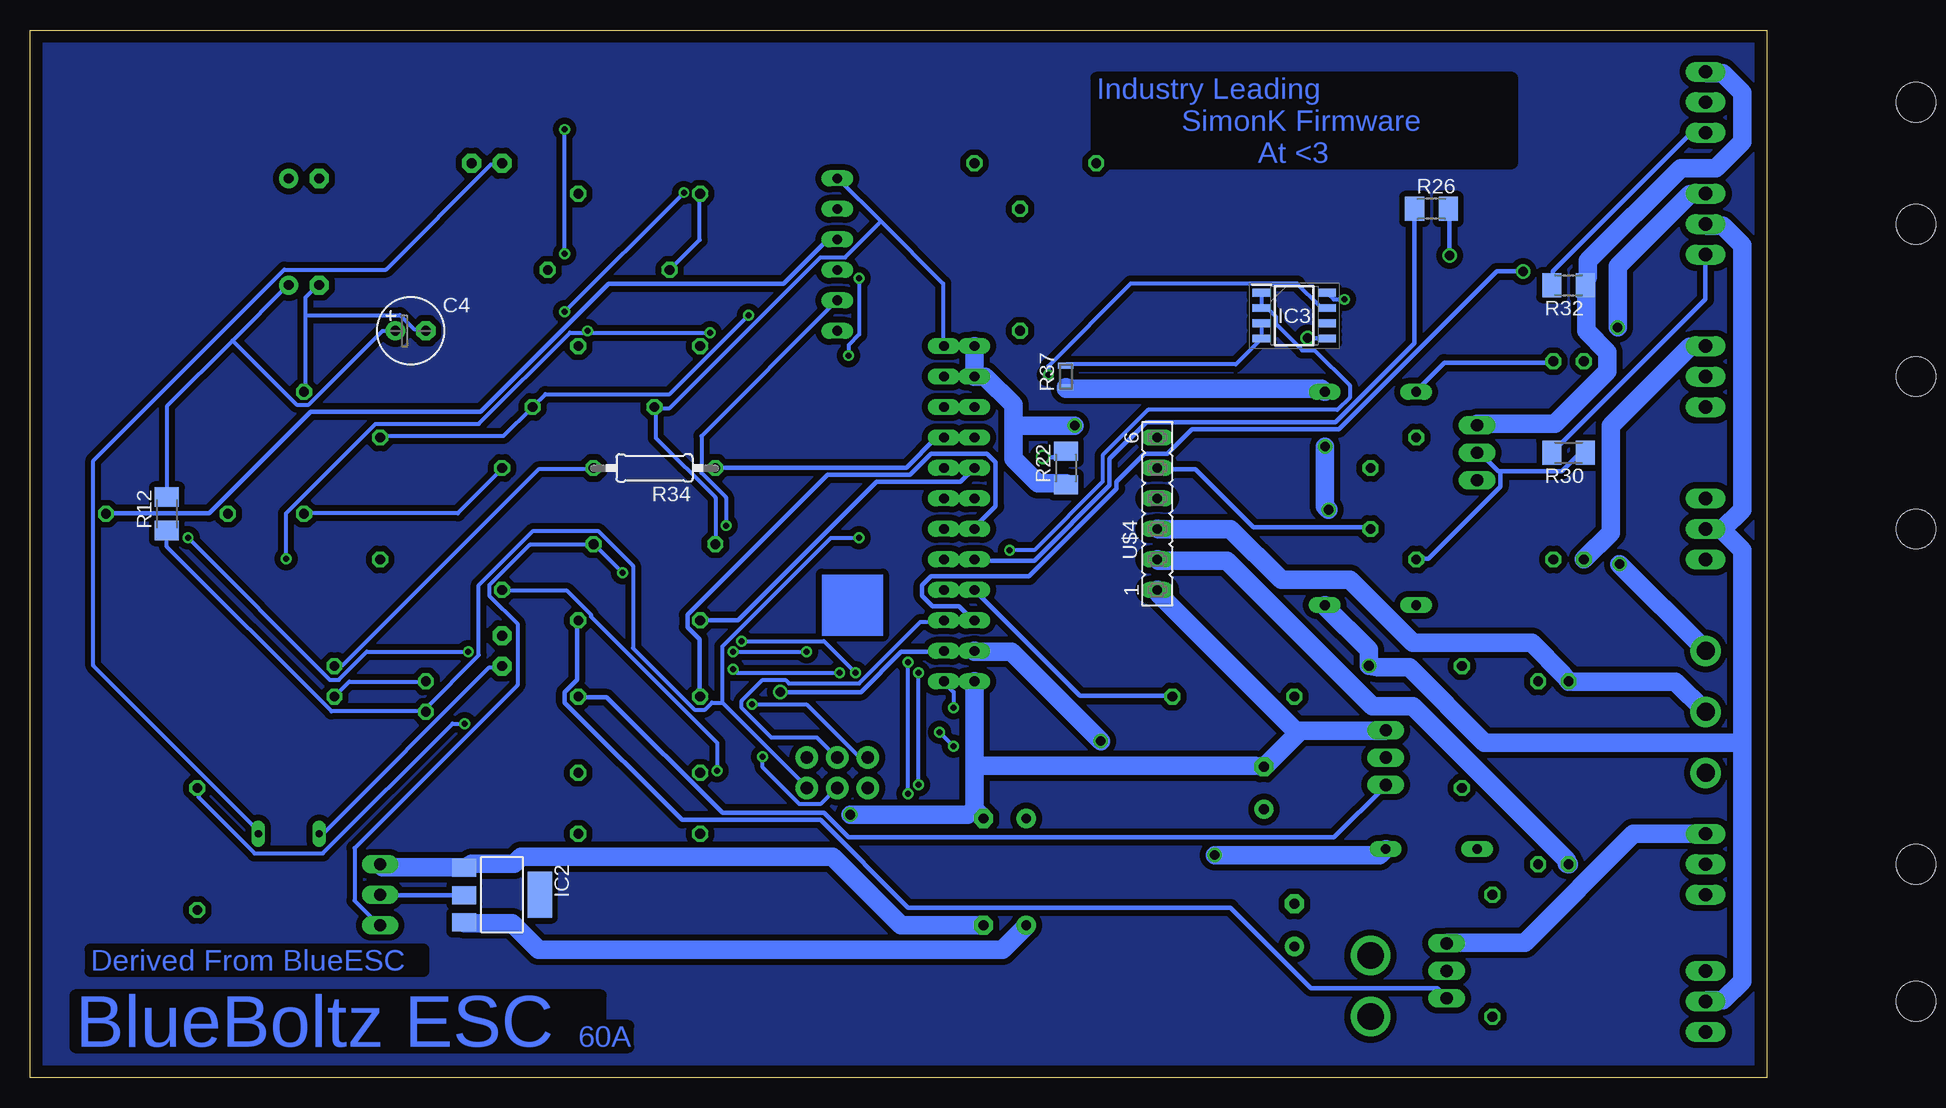
[diagram p7: board, bottom side, seen from below]

Size 144.76 x 87.3 mm. Coordinates in mm from the lower left corner, seen from the top.
Outline: 0,0 144.76,0 144.76,87.3 0,87.3 0,0
Copper layers (1*16): Top 0.035mm / dielectric 1.5mm / Bottom 0.035mm
Design rules "default": minimum track width 6mil, minimum drill 0.35mm, track to track 6mil, track to pad 6mil, pad to pad 6mil, via to via 6mil, smd to smd 6mil, copper to edge 40mil, drill to drill 6mil, minimum pad ring 10mil, minimum via ring 8mil, stop-mask expansion 4mil, vias tented up to drill 0mil, thermal gap 10mil

### Footprints (pad centres in the part's own frame; a part is rotated, then mirrored left to right if it is on the bottom)
SOT223 = smd 1.499 x 2.007: 1 -2.261,-3.15; 2 0.025,-3.15; 3 2.311,-3.15 | smd 3.81 x 2.007: 4 0,3.15
C025-040X050 = drill 0.813 octagon: 1 -1.27,0; 2 1.27,0
E2,5-6 = drill 0.813 pad 1.6: + -1.27,0 | drill 0.813 pad 1.6 octagon: - 1.27,0
C025-030X050 = drill 0.813 octagon: 1 -1.27,0; 2 1.27,0
C2.5-5 = drill 0.813 pad 1.6 octagon: 1 -1.27,0; 2 1.27,0
E2,5-7 = drill 0.813 pad 1.6: + -1.27,0 | drill 0.813 pad 1.6 octagon: - 1.27,0
E3,5-8 = drill 0.813 pad 1.6: + -1.778,0 | drill 0.813 pad 1.6 octagon: - 1.778,0
DO35-7 = drill 0.813 long: A 3.81,0; C -3.81,0
SOIC127P600X175-8N = smd 1.525 x 0.65: 1 -2.712,1.905; 2 -2.712,0.635; 3 -2.712,-0.635; 4 -2.712,-1.905; 5 2.712,-1.905; 6 2.712,-0.635; 7 2.712,0.635; 8 2.712,1.905
2X3-NS = drill 1.016 pad 1.88: 1 -2.54,-1.27; 2 -2.54,1.27; 3 0,-1.27; 4 0,1.27; 5 2.54,-1.27; 6 2.54,1.27
SMT-LED-3X2-RA = smd 2 x 1: 1 1.5,0; 2 -1.5,0
TO126AV = drill 1.016 long: B 2.286,-1.27; C 0,-1.27; E -2.286,-1.27
TO220BH = drill 1.118 long: D 0,-6.35; G -2.54,-6.35; S 2.54,-6.35 | hole 3.302: 0,11.176
QS = drill 0.61 long: 1 -2.54,0; 2 2.54,0
0207/10 = drill 0.813 octagon: 1 -5.08,0; 2 5.08,0
M3216 = smd 1.6 x 2: 1 -1.4,0; 2 1.4,0
R-5 = drill 0.813 octagon: 1 -2.54,0; 2 2.54,0
MINI_MELF-0102R = smd 0.5 x 1.3: 1 -0.9,0; 2 0.9,0
MA03-1 = drill 1.016 long: 1 -2.54,0; 2 0,0; 3 2.54,0
TQFP32-08 = smd 1.27 x 0.559: 1 -4.293,2.8; 2 -4.293,2; 3 -4.293,1.2; 4 -4.293,0.4; 5 -4.293,-0.4; 6 -4.293,-1.2; 7 -4.293,-2; 8 -4.293,-2.8; 17 4.293,-2.8; 18 4.293,-2; 19 4.293,-1.2; 20 4.293,-0.4; 21 4.293,0.4; 22 4.293,1.2; 23 4.293,2; 24 4.293,2.8 | smd 0.559 x 1.27: 9 -2.8,-4.293; 10 -2,-4.293; 11 -1.2,-4.293; 12 -0.4,-4.293; 13 0.4,-4.293; 14 1.2,-4.293; 15 2,-4.293; 16 2.8,-4.293; 25 2.8,4.293; 26 2,4.293; 27 1.2,4.293; 28 0.4,4.293; 29 -0.4,4.293; 30 -1.2,4.293; 31 -2,4.293; 32 -2.8,4.293
PAD-PTH-MED-1 = drill 2.2 pad 3.302: P$1 0,0
FE06 = drill 0.813 long: 1 -6.35,0; 2 -3.81,0; 3 -1.27,0; 4 1.27,0; 5 3.81,0; 6 6.35,0
PAD-PTH-18AWG-1 = drill 1.5 pad 2.54: P$1 0,0
FE12 = drill 0.813 long: 1 -13.97,0; 2 -11.43,0; 3 -8.89,0; 4 -6.35,0; 5 -3.81,0; 6 -1.27,0; 7 1.27,0; 8 3.81,0; 9 6.35,0; 10 8.89,0; 11 11.43,0; 12 13.97,0
PAD-1.5X3MM = smd 3 x 1.5: P$1 0,0

### Placement (x,y rotation side)
5VREG  91.44,8.89 90 top
C1  17.78,33.02 180 top
C2  16.51,59.69 180 top
C3  17.78,17.78 180 top
C4  113.03,62.23 0 bottom
C5  111.76,31.75 90 top
C6  119.38,33.02 270 top
C7  121.92,66.04 180 top
C8  106.68,76.2 180 top
C9  121.92,74.93 180 top
C10  16.51,43.18 180 top
C11  41.91,24.13 90 top
C12  105.41,35.56 270 top
C15  39.37,12.7 90 top
C16  63.5,12.7 0 top
C17  63.5,21.59 0 top
D1  27.94,19.05 0 top
D2  33.02,39.37 0 top
D3  33.02,57.15 0 top
IC2  105.41,15.24 270 bottom
IC3  ACS712ELCTR-20A-T  [SOIC127P600X175-8N]  39.37,63.5 0 bottom
J1  77.47,25.4 0 top
LED1  137.16,55.88 90 top
LED2  64.77,81.28 180 top
Q1  27.94,8.89 270 top
Q2  33.02,26.67 270 top
Q3  25.4,52.07 270 top
Q4  -1.27,6.35 90 top
Q5  -1.27,17.78 90 top
Q6  -1.27,45.72 90 top
Q7  -1.27,58.42 90 top
Q8  -1.27,71.12 90 top
Q9  -1.27,81.28 90 top
Q10  123.19,20.32 0 top
R1  115.57,48.26 90 top
R2  105.41,45.72 90 top
R3  96.52,67.31 180 top
R4  60.96,76.2 0 top
R5  133.35,46.99 0 top
R6  93.98,73.66 0 top
R7  97.79,55.88 0 top
R8  121.92,52.07 270 top
R9  93.98,60.96 180 top
R10  93.98,25.4 180 top
R11  93.98,20.32 0 top
R12  133.35,46.99 90 bottom
R13  121.92,43.18 90 top
R14  130.81,53.34 0 top
R15  130.81,58.42 0 top
R16  130.81,19.05 90 top
R17  22.86,10.16 90 top
R18  93.98,38.1 0 top
R19  15.24,6.35 180 top
R20  62.23,67.31 270 top
R21  58.42,39.37 180 top
R22  58.42,50.8 90 bottom
R23  25.4,29.21 90 top
R24  93.98,31.75 0 top
R25  19.05,26.67 180 top
R26  27.94,72.39 0 bottom
R27  24.13,64.77 90 top
R28  29.21,48.26 90 top
R29  44.45,31.75 180 top
R30  16.51,52.07 180 bottom
R31  16.51,72.39 0 top
R32  16.51,66.04 180 bottom
R33  33.02,48.26 90 top
R34  92.71,50.8 180 bottom
R35  92.71,44.45 0 top
R36  44.45,7.62 90 top
R37  58.42,58.42 90 bottom
R38  39.37,48.26 180 top
R39  21.59,43.18 0 top
R40  58.42,44.45 0 top
SV1  115.57,15.24 90 top
U1  76.2,39.37 0 top
U$1  33.02,5.08 0 top
U$2  33.02,10.16 0 bottom
U$4  50.8,46.99 90 bottom
U$5  5.08,25.4 0 top
U$6  5.08,30.48 0 top
U$7  5.08,35.56 0 top
U$8  66.04,46.99 270 top
U$11  85.09,81.28 0 top
U$12  100.33,81.28 0 top
U$13  95.25,81.28 0 top
U$14  90.17,81.28 0 top
U$16  77.47,68.58 270 top
U$17  68.58,46.99 270 top

### Tracks (layer width: path | path; a pad name or v marks a point on that pad's centre or on a via)
BEC+
  Bottom 0.381: IC2.2 108.66,15.19 115.53,15.19 SV1.2
CENTER  (via drill 0.5)
  Top 0.33: v87.48,25.56 81.79,19.86 75.51,19.86 73.61,21.76 73.61,27.31 74.19,27.9 74.19,35.05 U1.10 | 107.78,43.09 115.53,43.09 R1.1 | 107.78,43.09 105.45,40.75 R2.1 | 107.78,43.09 107.78,52.43 101.65,58.57 101.65,67.18 R3.1
  Bottom 0.33: v87.48,25.56 87.48,27.9 98,38.41 98,38.56 100.04,40.6 105.3,40.6 R2.1
CURRENT_ADC
  Top 0.381: R40.2 59.3,44.55 59.3,52.14 60.47,53.31 66.02,53.31 U$8.4
CURRENT_ADC_FILTERED
  Top 0.33: U1.26 78.28,43.52 78.28,42.94 78.58,42.65 79.45,42.65 86.46,49.66 96.69,49.66 97.71,50.68 R34.2
  Bottom 0.33: C6.1 119.32,34.32 118.74,34.32 102.38,50.68 97.85,50.68 R34.2
GATE_AH
  Top 0.381: R19.2 13.73,6.28 8.03,6.28 5.7,3.94 5.11,3.94 Q4.G
GATE_AL  (via drill 0.8)
  Top 0.381: v60.32,51.7 60.32,43.96 57.11,40.75 57.11,39.43 R21.2 56.96,39.29 55.21,37.53 51.41,37.53 38.12,24.24 38.12,22.78 29.5,14.17 22.35,14.17 21.32,15.19 5.11,15.19 Q5.G
  Bottom 0.381: v60.32,51.7 58.86,51.7 58.42,52.14 R22.2
GATE_BH
  Top 0.381: R25.2 17.53,26.73 17.53,30.09 5.11,42.5 5.11,43.09 Q6.G
GATE_BL  (via drill 0.8)
  Top 0.381: Q7.G 5.11,55.94 5.55,55.94 7.45,57.84 7.45,59.59 14.02,66.16 24.1,66.16 R27.2 24.24,66.31 v26.43,68.5
  Bottom 0.381: v26.43,68.5 26.43,72.3 R26.2
GATE_CH
  Bottom 0.381: R30.2 17.82,52.14 5.11,64.85 5.11,68.5 Q8.G
GATE_CL
  Top 0.381: R31.2 17.82,72.44 17.53,72.44 11.25,78.72 5.11,78.72 Q9.G
  Bottom 0.381: R32.2 17.82,66.16 17.82,67.18 6.28,78.72 5.11,78.72 Q9.G
GND  (via drill 0.8)
  Top 1.524: C16.- 65.28,21.47 C17.- | v76.38,21.91 80.91,21.91 82.23,23.22 82.23,24.98 80.62,26.58 80.03,26.58 J1.6 | Q1.E 26.73,11.1 32.13,11.1 33.01,10.22 U$2.P$1 33.59,10.66 37.39,14.46 39.29,14.46 C15.- 39.58,15.19 39.58,23.08 41.77,25.27 41.77,25.85 C11.- | v57.69,54.33 53.45,50.09 53.45,42.5 51.56,40.6 U$4.1 50.68,40.75 45.13,40.75 38.7,47.17 38.7,47.61 R38.2 38.41,48.34 36.07,50.68 33.15,50.68 R33.2 32.28,50.97 28.92,50.97 25.56,54.33 24.98,54.33 Q3.E | R27.1 24.24,63.24 24.24,54.48 Q3.E | C10.2 15.34,43.23 15.34,46.88 22.93,54.48 23.37,54.48 Q3.E
  Bottom 1.524: SV1.3 115.53,17.67 115.38,17.53 108.66,17.53 IC2.1 107.93,17.82 104.43,17.82 103.84,18.4 77.84,18.4 72.15,12.71 C16.- | 66.02,22.35 66.02,26 | 66.02,26 66.02,33.01 U$8.12 | 66.02,22.35 65.28,21.61 C17.- | v76.38,21.91 66.6,21.91 66.02,22.35 | 39.07,28.7 41.77,26 C11.- 42.65,26 66.02,26 | 39.07,28.7 38.85,28.92 31.84,28.92 Q2.E | Q5.S 5.11,20.3 11.1,20.3 20.16,11.25 26.58,11.25 Q1.E | 62.8,54.33 62.8,56.08 65.14,58.42 66.02,58.42 | 62.8,54.33 62.8,51.56 60.76,49.51 58.42,49.51 R22.1 | 66.02,58.42 U$8.2 | 66.02,58.42 66.02,60.9 U$8.1 | v57.69,54.33 62.8,54.33 | Q3.E 24.1,54.48 17.67,54.48 13.29,58.86 13.29,60.47 15.04,62.22 15.04,66.02 R32.1 14.9,66.75 14.9,68.06 7.16,75.8 4.24,75.8 2.04,77.99 2.04,82.08 3.65,83.69 4.97,83.69 Q9.S | C10.2 13,45.42 13,54.33 6.43,60.9 5.11,60.9 Q7.S | 39.07,28.7 50.68,40.31 50.68,40.6 U$4.1
L_CURRENT_ADC
  Bottom 0.381: R34.1 87.63,50.83 71.71,50.83 69.23,53.31 68.64,53.31 U$17.4
L_GND  (via drill 0.5)
  Top 0.33: 71.05,40.38 71.13,40.46 71.86,40.46 U1.3 | 71.05,40.38 70.83,40.16 70.83,39.29 71.13,38.99 71.86,38.99 U1.5 | 71.05,40.38 69.67,41.77 64.99,41.77 64.26,41.04 64.26,39.43 63.39,38.56 63.39,32.28 64.85,30.82 v67.77,30.82 67.77,28.77 73.03,23.51 73.03,21.47 75.22,19.28 88.94,19.28 | 88.94,19.28 88.94,20.3 R11.1 | 88.94,19.28 88.94,12.27 94.49,6.72 5VREG.1 94.64,6.72 95.66,7.74 95.81,7.74 119.32,31.25 119.32,31.69 C6.2 | U$17.2 68.64,58.42 68.64,60.9 U$17.1 | LED2.2 66.31,81.2 71.27,81.2 77.41,75.07 U$16.1 77.55,75.07 83.69,81.2 85,81.2 U$11.P$1 | C7.- 120.64,66.16 120.64,74.92 C9.- 120.49,74.92 119.32,76.09 108.08,76.09 C8.1 | C5.2 111.73,33.15 108.08,36.8 105.45,36.8 C12.1 105.3,36.95 101.8,36.95 94.35,44.4 87.78,44.4 R35.1 87.63,44.4 83.1,39.87 80.62,39.87 U1.21 | R7.1 92.74,55.94 94.06,55.94 99.02,60.9 R9.1 99.17,61.05 99.17,66.45 101.07,68.35 102.09,68.35 108.08,62.36 111.73,62.36 C4.-
  Bottom 0.33: v67.77,30.82 67.77,32.13 68.64,33.01 U$17.12 | 73.83,71.34 77.41,74.92 U$16.1 | 73.83,71.34 68.64,66.16 68.64,61.05 U$17.1 | 121.81,63.53 121.81,64.99 120.78,66.02 C7.- | 121.81,63.53 121.81,57.25 R8.1 | 121.81,63.53 113.92,63.53 112.75,62.36 111.87,62.36 C4.- | C5.2 111.87,33.01 118.15,33.01 119.32,31.84 C6.2 | R35.1 87.63,48.34 92.6,53.31 92.6,55.79 R7.1 92.45,55.79 91.43,55.79 78.87,68.35 76.82,68.35 73.83,71.34
L_PHASE_A
  Top 0.381: U$16.2 77.41,72.44 69.81,72.44 66.16,76.09 R4.2
L_PHASE_B
  Bottom 0.381: R5.2 138.31,47.03 129.84,47.03 121.37,55.5 107.2,55.5 96.54,66.16 81.93,66.16 78.28,69.81 77.55,69.81 U$16.3
L_PHASE_C
  Top 0.381: U$16.4 77.55,67.33 89.09,67.33 95.37,73.61 99.02,73.61 R6.2
L_PWM_AH
  Top 0.33: U1.32 73.32,43.67 73.32,46.59 69.23,50.68 68.64,50.68 U$17.5
L_PWM_AL
  Top 0.33: U$17.6 70.98,45.86 70.98,43.67 71.86,42.79 71.86,42.21 U1.1
L_PWM_BH
  Top 0.33: U1.2 71.86,41.48 71.13,41.48 70.4,42.21 70.4,43.96 68.64,45.71 U$17.7
L_PWM_BL  (via drill 0.5)
  Top 0.33: v68.94,28.77 73.32,33.15 73.32,35.05 U1.9 | v67.77,27.6 67.18,27.6 62.8,31.98 62.8,39.14 63.68,40.02 63.68,42.94 64.99,44.25 67.47,44.25 68.5,43.23 U$17.8
  Bottom 0.33: v67.77,27.6 v68.94,28.77
L_PWM_CH
  Top 0.33: U1.11 74.92,35.2 74.92,35.93 74.63,36.22 73.03,36.22 72.44,35.64 72.44,34.32 69.81,31.69 64.85,31.69 63.97,32.57 63.97,38.27 65.28,39.58 67.47,39.58 68.5,40.6 U$17.9
L_PWM_CL
  Top 0.33: U1.15 78.14,35.05 78.14,27.31 77.55,26.73 J1.4
  Bottom 0.33: U$17.10 68.64,37.97 70.54,37.97 75.65,32.86 81.5,32.86 81.79,33.15 83.69,33.15 85.44,31.4 85.44,30.82 82.96,28.33 79.16,28.33 77.55,26.73 J1.4
L_TEMP_ADC  (via drill 0.5)
  Top 0.33: v86.75,46.01 81.35,40.6 80.62,40.6 U1.22
  Bottom 0.33: v86.75,46.01 86.75,48.34 88.8,50.39 88.8,53.45 77.55,64.7 U$16.5
L_VBAT  (via drill 0.8)
  Top 0.381: 5VREG.3 94.49,11.25 94.49,19.72 88.94,25.27 R10.2 88.8,25.56 v82.23,32.13
  Bottom 0.381: v82.23,32.13 75.51,32.13 72.15,35.49 68.64,35.49 U$17.11
LED_STATUS  (via drill 0.5)
  Top 0.33: v80.03,35.49 79.31,36.22 77.84,36.22 77.41,35.78 77.41,35.2 U1.14 | v108.22,35.49 v86.17,35.49 | v131.59,44.98 131.59,48.78 137.14,54.33 LED1.2
  Bottom 0.33: v86.17,35.49 v80.03,35.49 | v108.22,35.49 116.69,35.49 119.03,33.15 119.76,33.15 v131.59,44.98
LED_WARN  (via drill 0.5)
  Top 0.33: v77.26,33.74 76.68,34.32 76.68,35.05 U1.13 | v86.17,34.03 103.99,34.03 v108.52,29.5
  Bottom 0.33: v77.26,33.74 85.88,33.74 v86.17,34.03 | v108.52,29.5 109.54,29.5 120.34,18.69 126.04,18.69 130.72,23.37 130.72,24.1 R16.2
MISO
  Top 0.33: U1.16 79.01,35.05 79.01,30.23 83.69,25.56 83.69,22.64 81.5,20.45 75.8,20.45 74.92,21.32 74.92,24.1 J1.1
N$1  (via drill 0.5)
  Top 0.33: v63.09,43.96 63.09,40.31 44.55,21.76 44.55,8.62 R36.2
  Bottom 0.33: v63.09,43.96 61.05,43.96 55.35,49.66 55.35,51.85 51.56,55.65 35.78,55.65 34.76,56.67 34.76,57.69 37.68,60.61 38.7,60.61 40.89,62.8 40.89,63.39 41.62,64.12 42.06,64.12 IC3.2 42.06,64.26 42.06,65.28 IC3.1
N$2
  Bottom 0.381: R18.2 99.17,37.97 99.17,33.15 100.19,32.13 100.19,31.25 90.41,21.47 78.87,21.47 71.56,14.17 44.69,14.17 37.97,7.45 27.46,7.45 26.73,6.72 Q1.B
N$3
  Top 0.381: LED2.1 63.39,81.35 64.26,81.35 65.43,82.52 96.83,82.52 98.29,81.06 98.29,79.6 105.01,72.88 112.02,72.88 130.13,54.77 130.42,54.77 130.72,54.48 130.72,25.56 129.69,24.54 129.69,15.04 130.72,14.02 R16.1
N$4
  Top 0.381: R19.1 16.65,6.28 21.61,6.28 22.78,5.11 R17.1 22.78,5.26 26.29,8.76 26.58,8.76 Q1.C
N$5
  Bottom 0.381: R24.2 99.02,31.69 96.69,31.69 87.05,22.05 78.58,22.05 76.53,20.01 36.07,20.01 31.84,24.24 Q2.B
N$6
  Top 0.381: R25.1 20.59,26.58 22.93,26.58 25.27,24.24 R23.1 25.56,24.24 27.9,26.58 31.69,26.58 Q2.C
N$7
  Top 0.381: R29.2 39.29,31.84 39.29,34.32 30.38,43.23 30.38,43.52 24.24,49.66 Q3.B
N$8
  Bottom 0.33: R37.2 58.42,59.44 44.25,59.44 42.21,61.49 IC3.4 42.06,61.63 42.06,62.8 IC3.3
N$9
  Bottom 0.381: 22.2,50.53 22.35,50.53 23.81,51.99 24.1,51.99 Q3.C | 22.2,50.53 17.09,50.53 15.63,51.99 15.19,51.99 R30.1 | 22.2,50.53 22.2,49.22 28.19,43.23 29.21,43.23 R28.1
N$10  (via drill 0.5)
  Top 0.33: v70.69,33.74 70.69,36.8 71.13,37.24 71.86,37.24 U1.7 | v70.69,24.39 70.69,22.05 87.92,4.82 110.12,4.82 125.6,20.3 Q10.2
  Bottom 0.33: v70.69,24.39 v70.69,33.74 | C8.2 105.45,76.09 106.32,76.09 115.09,67.33 123.56,67.33 139.48,51.41 139.48,34.32 125.6,20.45 Q10.2
N$11  (via drill 0.5)
  Top 0.33: v71.56,34.61 71.86,34.91 71.86,36.51 U1.8 | v71.56,23.66 71.56,22.05 88.21,5.4 100.34,5.4 115.23,20.3 120.64,20.3 Q10.1
  Bottom 0.33: v71.56,23.66 v71.56,34.61 | C12.2 105.45,34.18 106.47,34.18 120.2,20.45 120.64,20.45 Q10.1
N$12
  Top 0.381: 22.93,17.82 22.93,15.34 R17.2 | 22.93,17.82 24.1,18.99 D1.C | 22.93,17.82 19.13,17.82 C3.1
N$13  (via drill 0.8)
  Top 0.381: v38.27,61.63 38.85,61.05 38.85,57.25 40.16,55.94 40.16,48.34 R38.1
  Bottom 0.381: v38.27,61.63 36.66,61.63 IC3.5
N$14  (via drill 0.5)
  Top 0.33: v35.2,64.85 22.78,64.85 22.49,64.55 22.49,62.8 13.73,54.04 13.73,42.65 14.61,41.77 17.96,41.77 19.28,43.09 20.59,43.09 R39.1
  Bottom 0.33: v35.2,64.85 36.07,64.85 36.51,65.28 IC3.8
N$15
  Top 0.381: C1.1 19.13,33.15 24.24,33.15 25.27,34.18 R23.2 25.41,34.47 29.21,38.27 D2.C
N$16
  Top 0.381: LED1.1 137.14,57.25 133.49,57.25 133.2,56.96 131.01,56.96 129.55,58.42 R15.1
N$17  (via drill 0.5)
  Top 0.33: v59.88,58.57 59.88,54.48 57.54,52.14 57.54,44.55 R40.1
  Bottom 0.33: v59.88,58.57 59.88,59.3 53.02,66.16 39.14,66.16 37.24,64.26 36.66,64.26 IC3.7
N$18
  pour Top (isolate 0.762, rank 6): 0,87.63 0,0 144.78,0 144.78,87.63
N$19
  Top 0.381: D3.C R28.2
  Bottom 0.381: C2.1 17.82,59.59 26.87,59.59 29.21,57.25 D3.C
N$20
  pour Bottom (isolate 0.508): 0,87.63 0,0 144.78,0 144.78,87.63
PHASE_A
  Top 1.524: 8.03,17.82 5.11,17.82 Q5.D 4.38,17.53 3.5,17.53 2.04,16.07 2.04,14.46 4.97,11.54 4.97,8.91 Q4.S | 8.03,17.82 16.5,17.82 C3.2 | 8.03,17.82 8.03,21.18 5.11,24.1 5.11,25.27 U$5.P$1
  Bottom 1.524: U$4.2 50.68,43.09 44.98,43.09 32.86,30.96 29.5,30.96 16.65,18.11 16.65,17.82 C3.2
PHASE_B
  Top 1.524: Q7.D 3.8,58.42 2.04,56.67 2.04,55.06 4.97,52.14 4.97,48.34 Q6.S 4.24,48.2 3.8,48.2 2.04,46.44 2.04,33.45 4.97,30.52 U$6.P$1
  Bottom 1.524: 16.5,33.01 7.59,33.01 5.11,30.52 U$6.P$1 | 16.5,33.01 C1.2 | U$4.3 50.68,45.71 44.69,45.71 40.46,41.48 34.76,41.48 29.5,36.22 19.57,36.22 16.94,33.59 16.5,33.01
PHASE_C  (via drill 0.8)
  Top 1.524: v12.41,62.51 15.19,59.73 C2.2 14.9,59 12.27,56.38 v12.27,42.79 | U$4.4 50.68,48.34 49.8,48.34 40.31,57.84 40.31,62.22 21.32,81.2 5.11,81.2 Q9.D 4.38,81.06 3.5,81.06 2.04,79.6 2.04,77.99 4.97,75.07 4.97,73.75 Q8.S
  Bottom 1.524: v12.41,62.51 12.41,67.62 6.43,73.61 5.11,73.61 Q8.S | v12.27,42.79 5.11,35.64 U$7.P$1
PWM  (via drill 0.5)
  Top 0.33: v75.95,33.74 75.95,35.05 U1.12 | v85.44,36.37 89.67,36.37 v95.37,42.06 | v90.26,73.75 90.26,81.2 U$14.P$1 | v100.19,63.82 100.19,46.88 97.85,44.55 R35.2
  Bottom 0.33: v75.95,33.74 78.58,36.37 v85.44,36.37 | v95.37,42.06 97.71,44.4 R35.2 97.85,44.4 103.11,44.4 106.47,41.04 106.47,40.16 104.13,37.83 104.13,32.72 117.72,19.13 117.72,14.75 115.67,12.71 SV1.1 | v100.19,63.82 v90.26,73.75
PWM_AH
  Bottom 0.381: U$8.5 67.18,49.66 74.19,49.66 85.73,38.12 88.8,38.12 R18.1
PWM_AL
  Top 0.381: R21.1 59.88,39.43 59.88,42.06 66.02,48.2 U$8.6
PWM_BH
  Bottom 0.381: R24.1 88.94,31.84 88.94,36.51 89.97,37.53 89.97,38.56 78.28,50.24 71.42,50.24 69.67,51.99 64.99,51.99 64.26,51.26 64.26,47.61 66.02,45.86 U$8.7
PWM_BL
  Bottom 0.381: R26.1 29.36,72.3 29.36,61.2 35.93,54.62 51.7,54.62 54.77,51.56 54.77,49.37 61.05,43.09 66.02,43.09 U$8.8
PWM_CH
  Bottom 0.381: R29.1 49.66,31.84 57.25,31.84 66.02,40.6 U$8.9
PWM_CL  (via drill 0.8)
  Top 0.381: v20.3,67.18 15.19,72.3 R31.1
  Bottom 0.381: v20.3,67.18 22.49,67.18 35.64,54.04 47.9,54.04 49.95,51.99 51.85,51.99 54.19,49.66 54.19,49.07 61.49,41.77 69.67,41.77 70.4,41.04 70.4,40.16 69.52,39.29 67.33,39.29 66.16,38.12 U$8.10
RESET  (via drill 0.5)
  Top 0.33: v75.65,44.98 75.8,44.84 U1.29
  Bottom 0.33: v75.65,44.98 77.99,44.98 87.05,35.93 87.05,31.25 | 87.05,31.25 80.03,24.24 J1.5 | R12.1 133.34,45.57 133.34,44.25 119.61,30.52 111.87,30.52 C5.1 111.87,30.67 107.35,35.2 107.35,41.04 102.82,45.57 97.42,45.57 94.49,42.65 94.49,35.78 89.38,30.67 88.51,30.67 87.92,31.25 87.05,31.25
SCK  (via drill 0.5)
  Top 0.33: v83.69,26.73 81.2,29.21 81.2,35.49 80.62,36.07 80.62,36.51 U1.17
  Bottom 0.33: v83.69,26.73 83.69,25.85 80.62,22.78 78.87,22.78 77.55,24.1 J1.3
SCL  (via drill 0.5)
  Top 0.33: v76.53,60.17 76.53,43.67 U1.28 | v75.65,66.6 75.65,67.62 76.82,68.79 86.46,68.79 95.22,77.55 | 95.22,77.55 95.22,81.2 U$13.P$1 | 95.22,77.55 96.69,77.55 101.94,72.3 108.37,72.3 127.21,53.45 129.4,53.45 R14.1
  Bottom 0.33: v76.53,60.17 76.53,61.05 75.65,61.92 v75.65,66.6
SDA  (via drill 0.5)
  Top 0.33: v88.07,62.07 77.41,51.41 U1.27 | v123.41,43.23 121.95,41.77 R13.1 | v100.19,79.01 100.19,81.2 U$12.P$1 | v100.19,68.64 100.19,68.35 98.29,66.45 v98.29,62.22
  Bottom 0.33: 98.29,62.07 99.75,62.07 107.35,54.48 115.96,54.48 123.41,47.03 v123.41,43.23 | 98.29,62.07 v88.07,62.07 | v100.19,68.64 v100.19,79.01 | v98.29,62.22 98.29,62.07
SENSE_A  (via drill 0.5)
  Top 0.33: U1.23 80.62,41.48 81.35,41.48 85.88,46.01 85.88,46.3 86.46,46.88 92.89,46.88 96.98,42.79 98.88,42.79 106.47,50.39 106.47,52.29 102.97,55.79 R7.2 | v84.86,63.53 76.53,63.53 63.97,76.09 55.94,76.09 R4.1
  Bottom 0.33: v84.86,63.53 91.43,56.96 101.8,56.96 102.82,55.94 R7.2 102.97,55.79 105.3,53.45 115.53,53.45 R1.2
SENSE_B
  Top 0.33: R8.2 121.95,47.03 128.23,47.03 R5.1 | U1.24 80.62,42.21 80.91,42.21 86.17,47.47 93.18,47.47 97.27,43.38 98.29,43.38 105.3,50.39 105.3,50.68 R2.2
  Bottom 0.33: R8.2 121.81,47.03 109.1,47.03 105.45,50.68 R2.2
SENSE_C
  Top 0.33: U1.25 79.01,43.67 79.01,51.12 88.8,60.9 R9.2 88.94,61.05 91.43,63.53 91.43,67.18 R3.2
  Bottom 0.33: R6.1 88.94,73.61 88.94,69.81 91.43,67.33 R3.2
TEMP_ADC
  Top 0.381: R20.1 62.22,72.3 62.22,67.04 49.07,53.89 49.07,52.43 50.68,50.83 U$4.5
  Bottom 0.381: R33.1 33.15,45.86 42.79,45.86 47.61,50.68 50.68,50.68 U$4.5
VBAT  (via drill 0.8)
  Top 1.524: v33.15,34.32 34.61,32.86 34.61,23.66 31.84,20.89 31.84,19.13 D1.A | v46.01,18.55 v55.5,28.04 | v36.8,52.58 36.8,57.11 D3.A | v36.51,47.32 36.51,39.73 36.8,39.43 D2.A
  Bottom 1.524: 2.04,27.9 2.04,43.96 3.72,45.64 | 2.04,27.9 2.04,8.03 3.65,6.43 4.97,6.43 Q4.D | 3.72,45.64 3.8,45.71 4.97,45.71 Q6.D | 3.72,45.64 2.04,47.32 2.04,69.37 3.65,70.98 4.97,70.98 Q8.D | R37.1 58.42,57.4 37.1,57.4 36.95,57.25 D3.A | D2.A 36.8,39.29 33.15,35.64 v33.15,34.32 32.42,34.18 29.79,34.18 23.51,27.9 2.04,27.9 | v55.5,28.04 62.95,35.49 66.02,35.49 U$8.11 | v46.01,18.55 32.28,18.55 31.84,18.99 D1.A | v36.8,52.58 36.8,47.61 v36.51,47.32
VBAT+
  Top 1.524: 44.4,6.86 43.38,6.86 39.43,10.81 C15.+ | 44.4,6.86 R36.1 | C11.+ 41.77,22.35 41.77,13.58 39.73,11.54 C15.+ | U$1.P$1 33.15,5.11 38.7,10.66 C15.+ | C17.+ 61.78,21.47 61.78,12.71 C16.+ 61.05,12.41 55.65,7.01 45.13,7.01 44.4,6.86
  Bottom 1.524: IC2.3 108.52,12.85 104.57,12.85 102.38,10.66 63.68,10.66 61.78,12.56 C16.+
VBAT_ADC
  Top 0.33: U1.19 80.62,38.12 81.35,38.12 85.29,34.18 85.29,33.74 93.62,25.41 99.02,25.41 R10.1 99.02,25.27 99.02,20.45 R11.2
VCC5V  (via drill 0.5)
  Top 0.33: U1.20 80.47,38.85 79.6,38.85 79.45,38.7 79.45,37.68 79.74,37.39 80.47,37.39 U1.18 80.62,37.24 81.35,37.24 84.71,33.88 84.71,31.11 | 84.71,31.11 96.1,19.72 96.1,19.28 | 96.1,19.28 96.1,10.37 94.64,8.91 5VREG.2 | v84.56,31.11 84.71,31.11 | 72.66,39.65 72.59,39.73 72,39.73 U1.4 | 72.66,39.65 73.03,39.29 73.03,38.56 72.73,38.27 72,38.27 U1.6 | 72.66,39.65 73.03,40.02 73.03,42.5 71.56,43.96 71.56,47.47 69.37,49.66 64.99,49.66 64.26,50.39 64.26,51.26 65.28,52.29 69.67,52.29 70.4,53.02 70.4,54.04 69.81,54.62 | 69.81,54.62 68.64,55.79 U$17.3 | 69.81,54.62 77.41,62.22 U$16.6 77.55,62.36 85,62.36 92.16,69.52 107.06,69.52 114.21,62.36 C4.+ 114.36,62.22 114.36,53.02 121.81,45.57 121.81,44.69 R13.2 121.81,44.55 120.49,43.23 120.49,40.16 112.31,31.98 111.73,31.98 110.71,30.96 110.71,30.38 99.61,19.28 96.1,19.28 | R14.2 132.32,53.45 134.07,53.45 136.56,55.94 137.87,55.94 138.16,56.23 138.16,58.42 137.72,58.86 132.76,58.86 132.32,58.42 R15.2 132.18,58.57 131.59,58.57 124,66.16 123.41,66.16 C7.+ 123.27,66.16 123.27,74.92 C9.+
  Bottom 0.33: v84.56,31.11 80.03,31.11 75.65,26.73 75.07,26.73 J1.2 | 127.87,61.41 123.27,66.02 C7.+ | 127.87,61.41 133.34,55.94 133.34,48.49 R12.2 | 127.87,61.41 122.54,56.08 121.51,56.08 115.38,62.22 114.36,62.22 C4.+
VCC5V-1
  Top 0.381: R20.2 53.45,53.45 50.83,53.45 U$4.6
VCC5V-2
  Top 0.381: C10.1 17.82,43.23 18.84,44.25 21.32,44.25 22.35,43.23 R39.2 22.64,43.09 27.75,43.09 30.96,39.87 30.96,38.56 38.85,30.67 39.87,30.67 47.32,38.12 52.72,38.12 58.27,43.67 58.27,51.99 62.07,55.79 66.02,55.79 U$8.3
(copper drawn outside any net)
  shapes: Bottom area x1, Top area x1

### Text on the board
Top: Industry Leading / SimonK Firmware at Heart. | Derived from BlueESC | 60A Max Load Power | BlueBoltz ESC
Bottom: Industry Leading / SimonK Firmware / At <3 | Derived From BlueESC | 60A | BlueBoltz ESC